# Altium project MiniPC.PrjPcb (part 1 of 17)
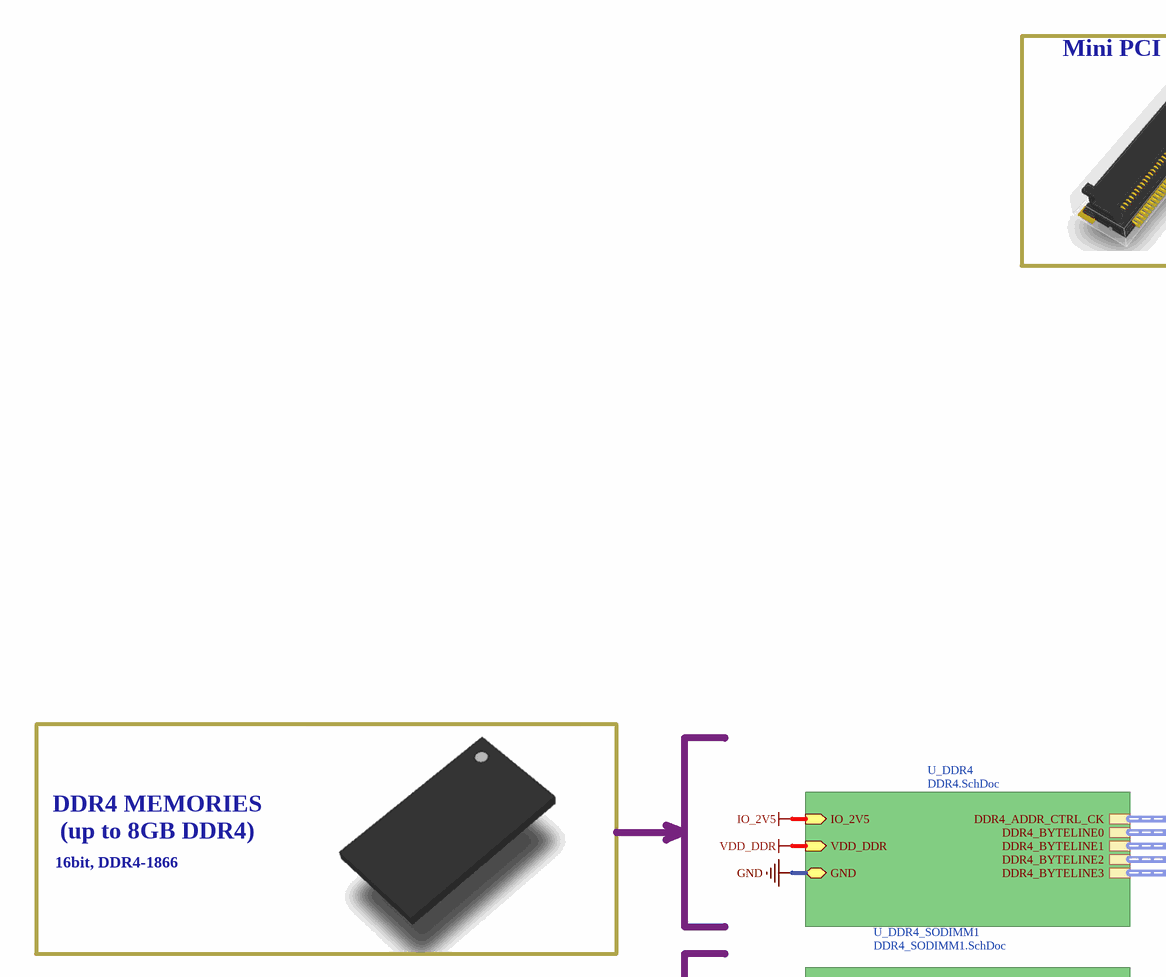
[diagram p0: MiniPC_Func.SchDoc, top left]
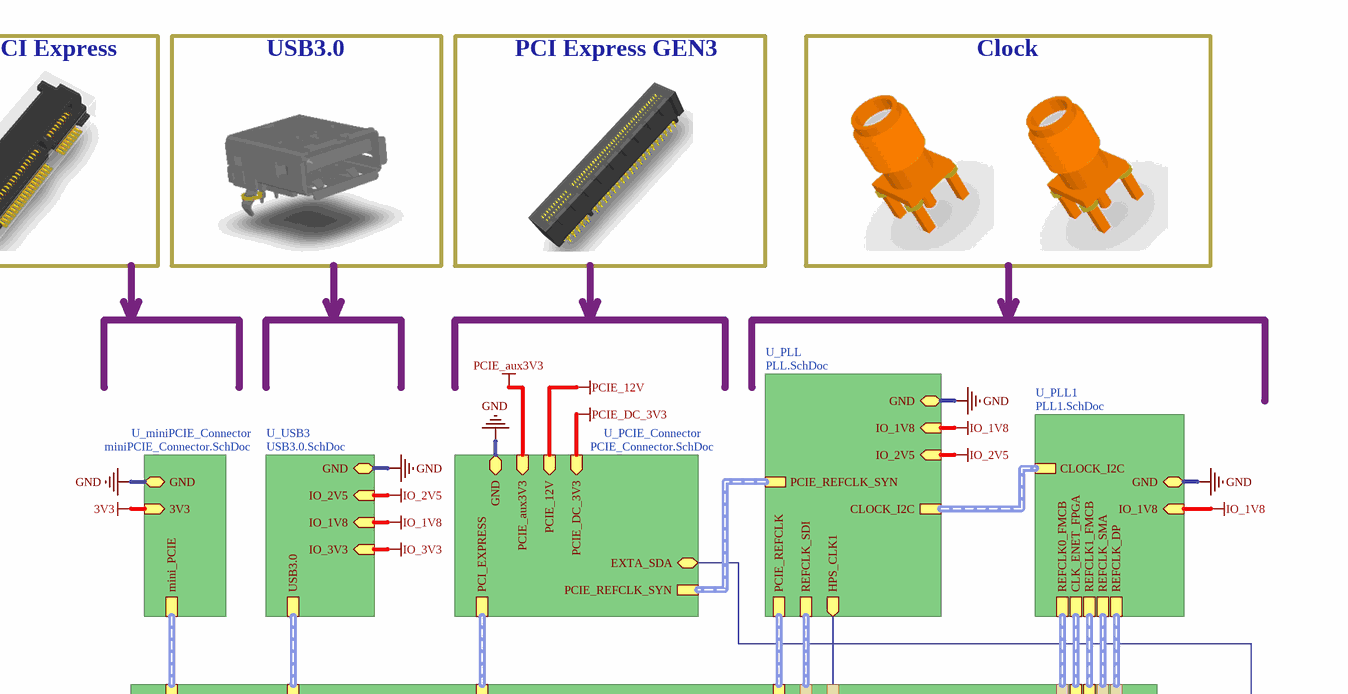
[diagram p1: MiniPC_Func.SchDoc, top middle]
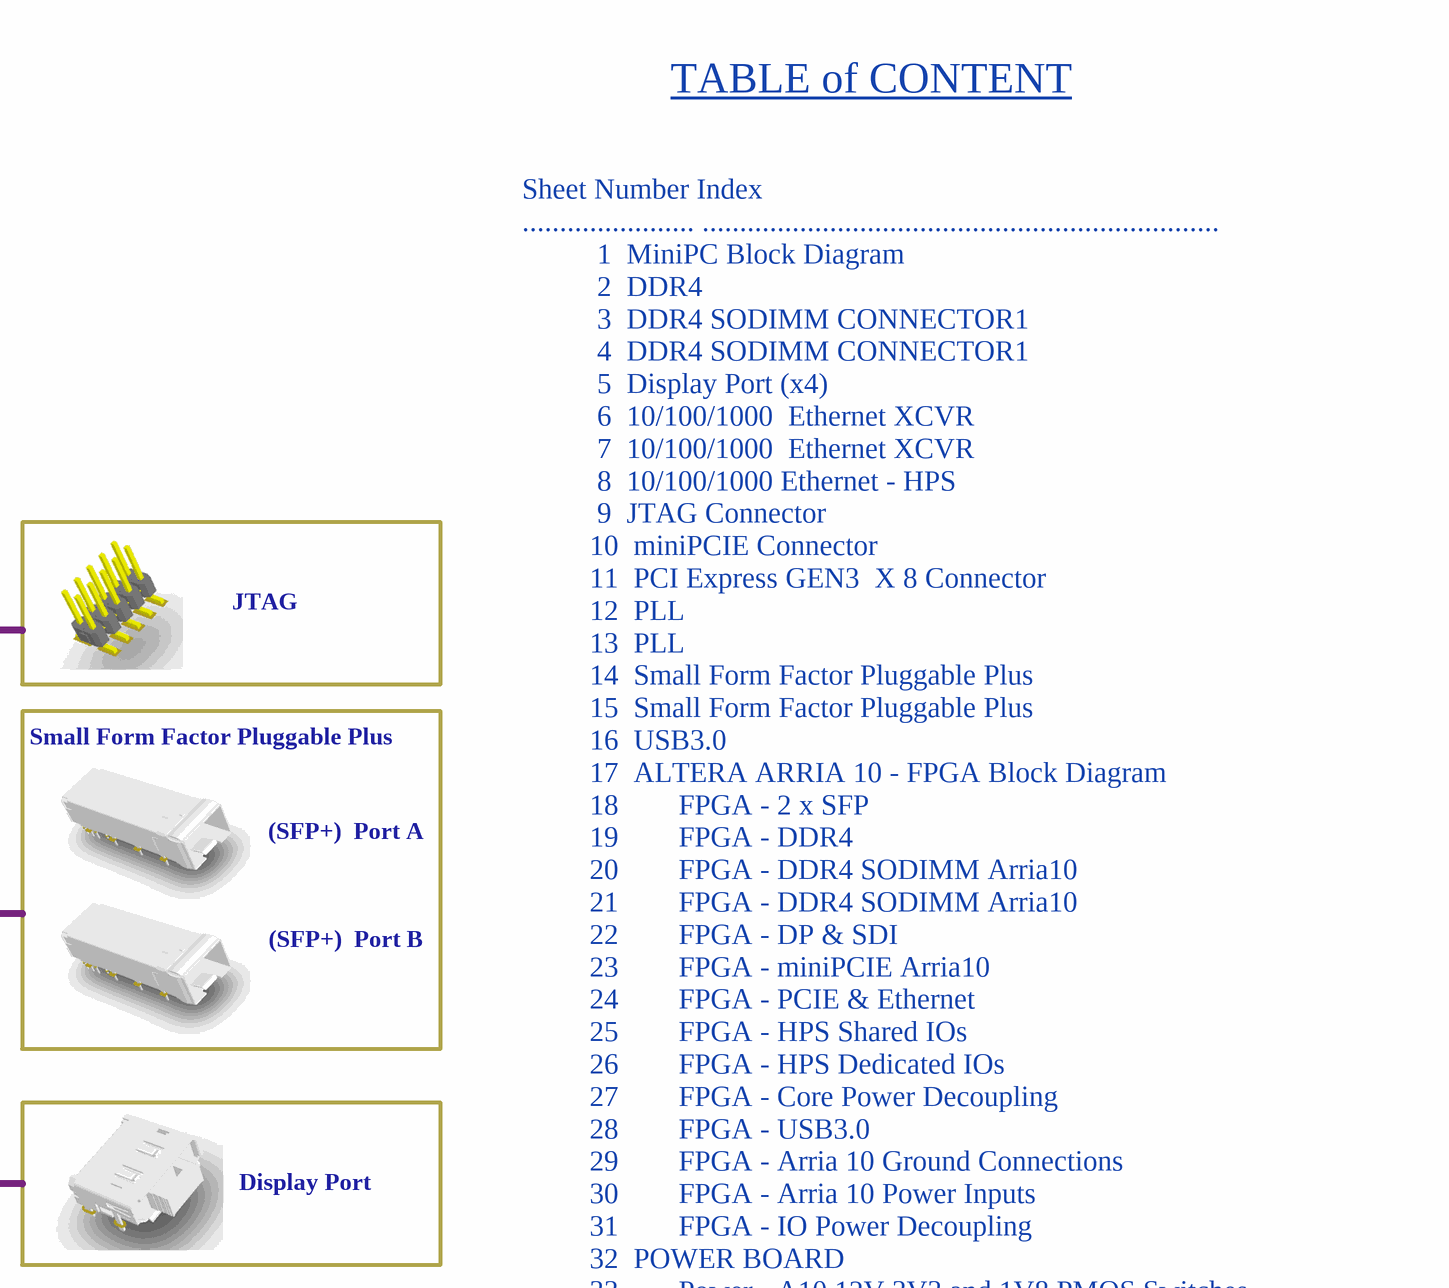
[diagram p2: MiniPC_Func.SchDoc, top right]
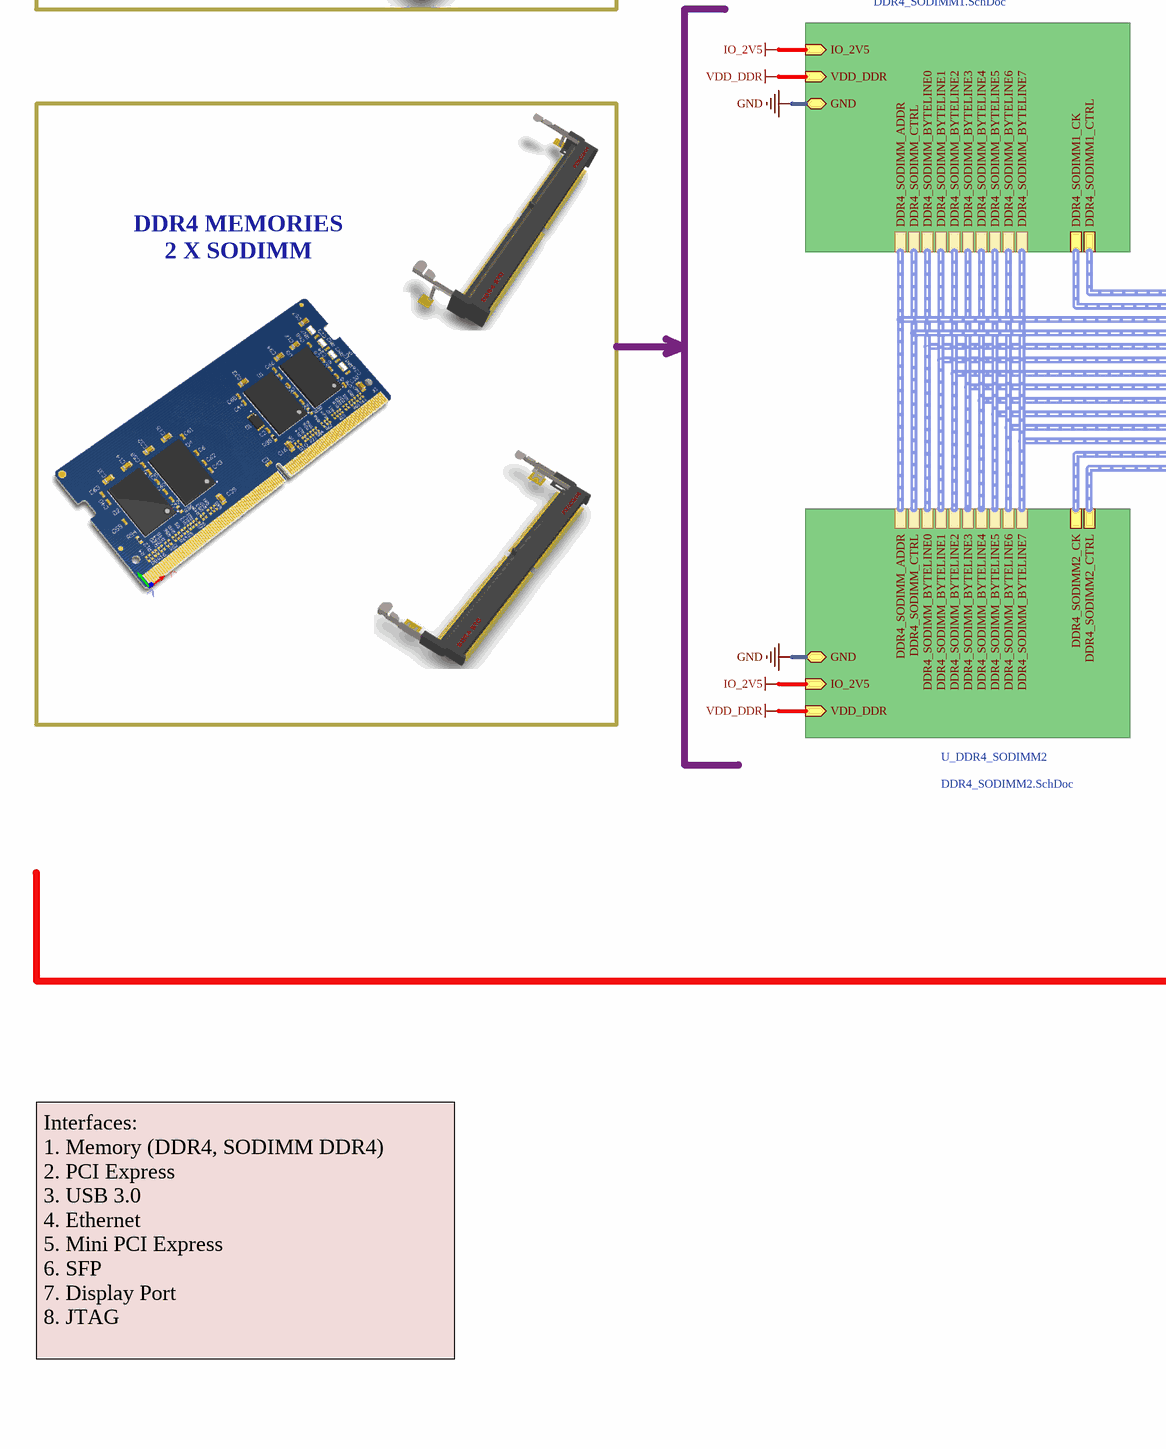
[diagram p3: MiniPC_Func.SchDoc, bottom left]
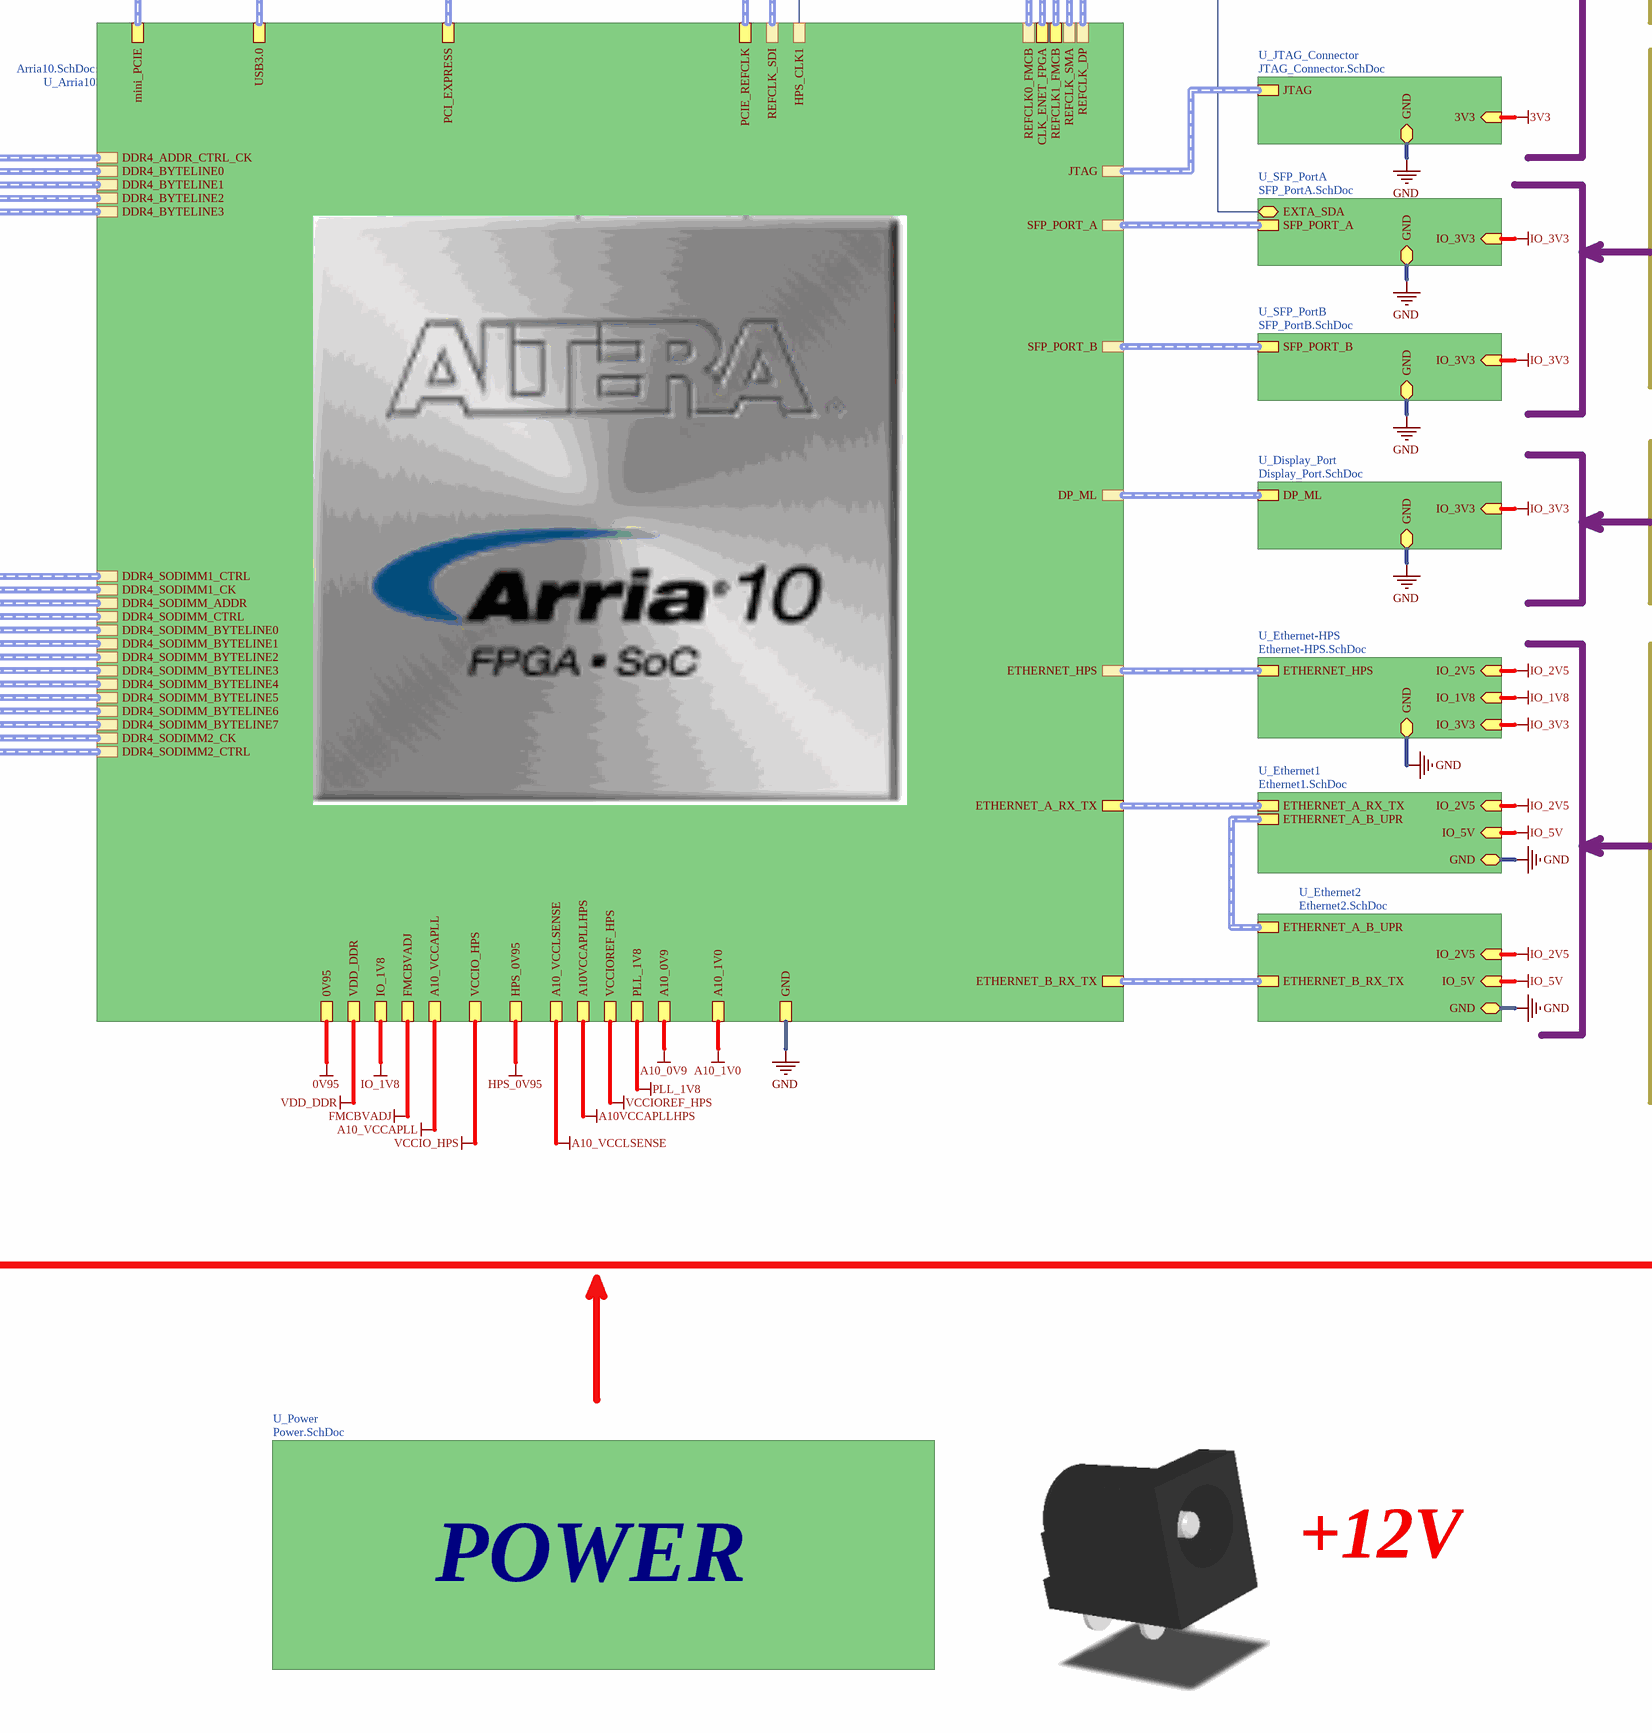
[diagram p4: MiniPC_Func.SchDoc, bottom middle]
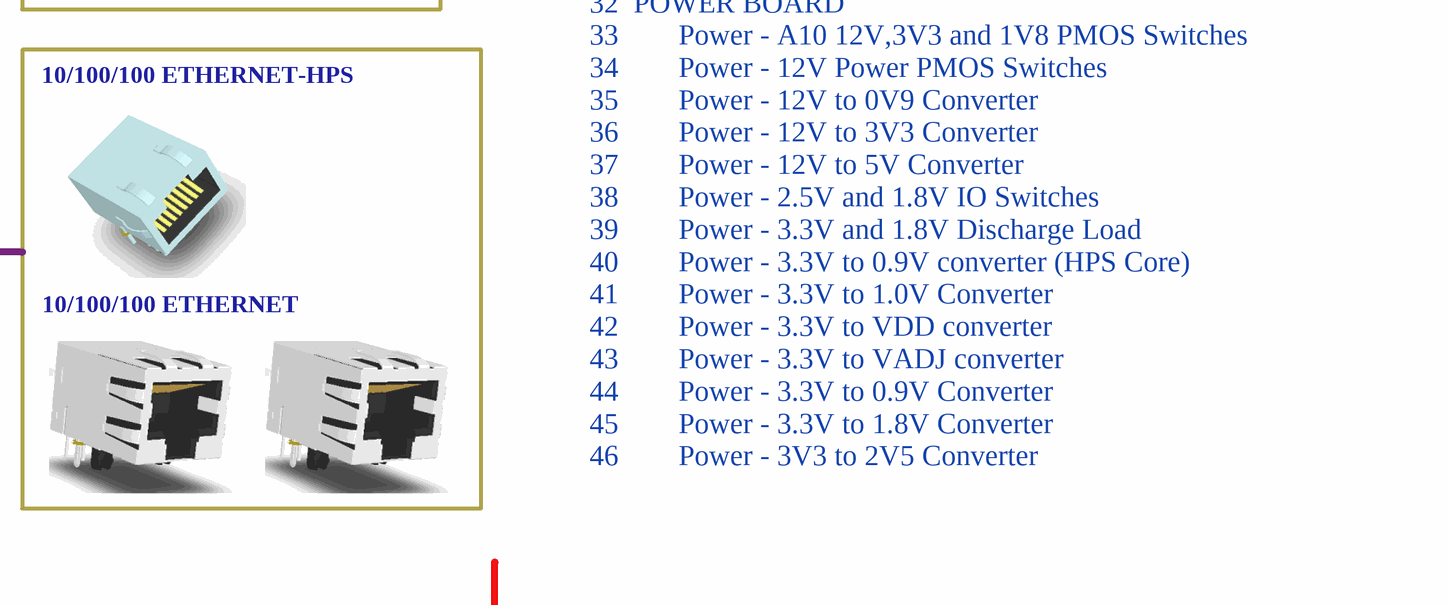
[diagram p5: MiniPC_Func.SchDoc, bottom right]
Project: Mini PC Motherboard; PrjCompanyName: Altium; PrjAddress4: 92037; PrjAddress3: La Jolla, CA, USA; PrjAddress2: Suite 700; PrjAddress1: 4225 Executive Sqr; CompanyWebsite: www.altium.com
46 sheets, 1044 parts. Net scope: hierarchical (ports join the sheet entries above them; power ports are global).
Board file: MiniPC.PcbDoc
Sheets:
  MiniPC_Func.SchDoc
    U_Arria10 = Arria10.SchDoc
      Core_Power_Capacitors = Core_Power_Decoupling.SchDoc
      IO_Power_Capacitors = IO_Power_Decoupling.SchDoc
      U_DDR4_Arria10 = DDR4_Arria10.SchDoc
      U_DDR4_SODIMM1_Arria10 = DDR4_SODIMM1_Arria10.SchDoc
      U_DDR4_SODIMM_Arria10 = DDR4_SODIMM_Arria10.SchDoc
      U_miniPCIE_Arria10 = miniPCIE_Arria10.SchDoc
      U_USB3 = USB3.0_Arria10.SchDoc
      U_PCIE_Arria10 = PCIE_Arria10.SchDoc
      U_HPS_Arria10 = HPS_Arria10.SchDoc
      U_DP&SDI_Arria10 = DP&SDI_Arria10.SchDoc
      U_2XSFP_Arria10 = 2XSFP_Arria10.SchDoc
      U_HPS1_Arria10 = HPS1_Arria10.SchDoc
      U_Arria10_Power = Arria10_Power.SchDoc
      U_Arria10_Ground = Arria10_Ground.SchDoc
    U_DDR4 = DDR4.SchDoc
    U_DDR4_SODIMM1 = DDR4_SODIMM1.SchDoc
    U_DDR4_SODIMM2 = DDR4_SODIMM2.SchDoc
    U_Ethernet-HPS = Ethernet-HPS.SchDoc
    U_SFP_PortA = SFP_PortA.SchDoc
    U_SFP_PortB = SFP_PortB.SchDoc
    U_JTAG_Connector = JTAG_Connector.SchDoc
    U_Display_Port = Display_Port.SchDoc
    U_Ethernet1 = Ethernet1.SchDoc
    U_Ethernet2 = Ethernet2.SchDoc
    U_miniPCIE_Connector = miniPCIE_Connector.SchDoc
    U_USB3 = USB3.0.SchDoc
    U_PCIE_Connector = PCIE_Connector.SchDoc
    U_PLL1 = PLL1.SchDoc
    U_PLL = PLL.SchDoc
    U_Power = Power.SchDoc
      12V_POWER = 12V_POWER.SchDoc
      12V_3V3_1V8_Swiches = 12V_3V3_1V8_Swiches.SchDoc
      12V_to_0V9 = 12V_to_0V9.SchDoc
      12V_to_3V3 = 12V_to_3V3.SchDoc
      12V_to_5V = 12V_to_5V.SchDoc
      3V3 to 0V9_Core = 3.3V_to_0.9V.SchDoc
      3V3 to 1V0 = 3.3V_to_1.0V.SchDoc
      3V3 to VDD DDR4 = 3.3V_to_DDR4_VDD.SchDoc
      3V3 to VADJ = 3.3V_to_VADJ.SchDoc
      3V3_to_0V9_Converter = 3V3_to_0V9.SchDoc
      3V3_to_2V5 = 3V3_to_2V5.SchDoc
      3V3_to_1V8 = 3V3_to_1V8.SchDoc
      2V5 and 1V8 Switches = 2.5V_and_1.8V_Switches.SchDoc
      3.3V_and_1.8V_Load = 3.3V_and_1.8V_Load.SchDoc

## Sheet MiniPC_Func.SchDoc: MiniPC Block Diagram
size D; DocumentNumber: 1; SheetNumber: 1; SheetTotal: 46

### Sub-sheets
U_Arria10 = Arria10.SchDoc: IO_1V8, VDD_DDR, FMCBVADJ, A10_VCCAPLL, HPS_0V95, VCCIO_HPS, VCCIOREF_HPS, A10VCCAPLLHPS, A10_VCCLSENSE, 0V95, PLL_1V8, A10_1V0, A10_0V9, DDR4_ADDR_CTRL_CK, DDR4_BYTELINE0, DDR4_BYTELINE1, DDR4_BYTELINE2, DDR4_BYTELINE3, DDR4_SODIMM_ADDR, DDR4_SODIMM1_CK, DDR4_SODIMM2_CK, DDR4_SODIMM_BYTELINE0, DDR4_SODIMM_BYTELINE1, DDR4_SODIMM_BYTELINE2, DDR4_SODIMM_BYTELINE3, DDR4_SODIMM_BYTELINE4, DDR4_SODIMM_BYTELINE5, DDR4_SODIMM_BYTELINE6, DDR4_SODIMM_BYTELINE7, DDR4_SODIMM_CTRL, DDR4_SODIMM1_CTRL, DDR4_SODIMM2_CTRL, mini_PCIE, JTAG, SFP_PORT_A, SFP_PORT_B, REFCLK0_FMCB, REFCLK_SMA, REFCLK_DP, REFCLK_SDI, DP_ML, ETHERNET_HPS, HPS_CLK1, USB3.0, ETHERNET_A_RX_TX, ETHERNET_B_RX_TX, PCI_EXPRESS, CLK_ENET_FPGA, PCIE_REFCLK, REFCLK1_FMCB, GND
U_DDR4 = DDR4.SchDoc: DDR4_ADDR_CTRL_CK (harness DDR4_ADDR_CTRL_CK), DDR4_BYTELINE0 (harness DDR4_BYTELINE0), DDR4_BYTELINE1 (harness DDR4_BYTELINE1), DDR4_BYTELINE2 (harness DDR4_BYTELINE2), DDR4_BYTELINE3 (harness DDR4_BYTELINE3), IO_2V5 (in), VDD_DDR (in), GND
U_DDR4_SODIMM1 = DDR4_SODIMM1.SchDoc: DDR4_SODIMM1_CTRL (harness DDR4_SODIMM1_CTRL), DDR4_SODIMM_BYTELINE0 (harness DDR4_SODIMM_BYTELINE0), DDR4_SODIMM_BYTELINE1 (harness DDR4_SODIMM_BYTELINE1), DDR4_SODIMM_BYTELINE2 (harness DDR4_SODIMM_BYTELINE2), DDR4_SODIMM_BYTELINE3 (harness DDR4_SODIMM_BYTELINE3), DDR4_SODIMM_BYTELINE4 (harness DDR4_SODIMM_BYTELINE4), DDR4_SODIMM_BYTELINE5 (harness DDR4_SODIMM_BYTELINE5), DDR4_SODIMM_BYTELINE6 (harness DDR4_SODIMM_BYTELINE6), DDR4_SODIMM_BYTELINE7 (harness DDR4_SODIMM_BYTELINE7), DDR4_SODIMM_ADDR (harness DDR4_SODIMM_ADDR), DDR4_SODIMM_CTRL (harness DDR4_SODIMM_CTRL), DDR4_SODIMM1_CK (harness DDR4_SODIMM1_CK), IO_2V5 (in), VDD_DDR (in), GND
U_DDR4_SODIMM2 = DDR4_SODIMM2.SchDoc: DDR4_SODIMM_ADDR (harness DDR4_SODIMM_ADDR), DDR4_SODIMM_CTRL (harness DDR4_SODIMM_CTRL), DDR4_SODIMM_BYTELINE0 (harness DDR4_SODIMM_BYTELINE0), DDR4_SODIMM_BYTELINE1 (harness DDR4_SODIMM_BYTELINE1), DDR4_SODIMM_BYTELINE2 (harness DDR4_SODIMM_BYTELINE2), DDR4_SODIMM_BYTELINE3 (harness DDR4_SODIMM_BYTELINE3), DDR4_SODIMM_BYTELINE4 (harness DDR4_SODIMM_BYTELINE4), DDR4_SODIMM_BYTELINE5 (harness DDR4_SODIMM_BYTELINE5), DDR4_SODIMM_BYTELINE6 (harness DDR4_SODIMM_BYTELINE6), DDR4_SODIMM_BYTELINE7 (harness DDR4_SODIMM_BYTELINE7), DDR4_SODIMM2_CTRL (harness DDR4_SODIMM2_CTRL), DDR4_SODIMM2_CK (harness DDR4_SODIMM2_CK), IO_2V5 (in), VDD_DDR (in), GND
U_Display_Port = Display_Port.SchDoc: DP_ML (harness DP_ML), IO_3V3 (in), GND
U_Ethernet1 = Ethernet1.SchDoc: ETHERNET_A_RX_TX (harness ETHERNET_A_RX_TX), ETHERNET_A_B_UPR (harness ETHERNET_A_B_UPR), IO_2V5 (in), IO_5V (in), GND
U_Ethernet2 = Ethernet2.SchDoc: ETHERNET_A_B_UPR (harness ETHERNET_A_B_UPR), ETHERNET_B_RX_TX (harness ETHERNET_B_RX_TX), IO_2V5 (in), IO_5V (in), GND
U_Ethernet-HPS = Ethernet-HPS.SchDoc: ETHERNET_HPS (harness ETHERNET_HPS), IO_1V8 (in), IO_2V5 (in), IO_3V3 (in), GND
U_JTAG_Connector = JTAG_Connector.SchDoc: JTAG (harness JTAG), 3V3 (in), GND
U_miniPCIE_Connector = miniPCIE_Connector.SchDoc: mini_PCIE (harness mini_PCIE), 3V3 (in), GND
U_PCIE_Connector = PCIE_Connector.SchDoc: EXTA_SDA (bidir), PCI_EXPRESS (harness PCI_EXPRESS), PCIE_REFCLK_SYN (harness PCIE_REFCLK_SYN), PCIE_DC_3V3 (in), PCIE_12V (in), PCIE_aux3V3 (in), GND
U_PLL = PLL.SchDoc: PCIE_REFCLK (harness REFCLK), PCIE_REFCLK_SYN (harness PCIE_REFCLK_SYN), REFCLK_SDI (harness REFCLK_SDI), HPS_CLK1 (out), CLOCK_I2C (harness CLOCK_I2C), IO_2V5 (in), IO_1V8 (in), GND
U_PLL1 = PLL1.SchDoc: REFCLK0_FMCB (harness REFCLK0_FMCB), CLK_ENET_FPGA (harness CLK_ENET), REFCLK1_FMCB (harness REFCLK1_FMCB), REFCLK_SMA (harness REFCLK_SMA), REFCLK_DP (harness REFCLK_DP), CLOCK_I2C (harness CLOCK_I2C), IO_1V8 (in), GND
U_Power = Power.SchDoc: no entries
U_SFP_PortA = SFP_PortA.SchDoc: EXTA_SDA (bidir), SFP_PORT_A (harness SFP_PORT_A), IO_3V3 (in), GND
U_SFP_PortB = SFP_PortB.SchDoc: SFP_PORT_B (harness SFP_PORT_B), IO_3V3 (in), GND
U_USB3 = USB3.0.SchDoc: USB3.0 (harness USB3.0), IO_1V8 (in), IO_2V5 (in), IO_3V3 (in), GND

### Nets
3V3: sheet U_JTAG_Connector/3V3, sheet U_miniPCIE_Connector/3V3
GND: sheet U_Arria10/GND, sheet U_DDR4/GND, sheet U_DDR4_SODIMM1/GND, sheet U_DDR4_SODIMM2/GND, sheet U_Ethernet-HPS/GND, sheet U_SFP_PortA/GND, sheet U_SFP_PortB/GND, sheet U_JTAG_Connector/GND, sheet U_Display_Port/GND, sheet U_Ethernet1/GND, sheet U_Ethernet2/GND, sheet U_miniPCIE_Connector/GND, sheet U_USB3/GND, sheet U_PCIE_Connector/GND, sheet U_PLL1/GND, sheet U_PLL/GND
IO_1V8: sheet U_Arria10/IO_1V8, sheet U_Ethernet-HPS/IO_1V8, sheet U_USB3/IO_1V8, sheet U_PLL1/IO_1V8, sheet U_PLL/IO_1V8
IO_2V5: sheet U_DDR4/IO_2V5, sheet U_DDR4_SODIMM1/IO_2V5, sheet U_DDR4_SODIMM2/IO_2V5, sheet U_Ethernet-HPS/IO_2V5, sheet U_Ethernet1/IO_2V5, sheet U_Ethernet2/IO_2V5, sheet U_USB3/IO_2V5, sheet U_PLL/IO_2V5
IO_3V3: sheet U_Ethernet-HPS/IO_3V3, sheet U_SFP_PortA/IO_3V3, sheet U_SFP_PortB/IO_3V3, sheet U_Display_Port/IO_3V3, sheet U_USB3/IO_3V3
IO_5V: sheet U_Ethernet1/IO_5V, sheet U_Ethernet2/IO_5V
VDD_DDR: sheet U_Arria10/VDD_DDR, sheet U_DDR4/VDD_DDR, sheet U_DDR4_SODIMM1/VDD_DDR, sheet U_DDR4_SODIMM2/VDD_DDR
EXTA_SDA: sheet U_SFP_PortA/EXTA_SDA, sheet U_PCIE_Connector/EXTA_SDA
HPS_CLK1: sheet U_Arria10/HPS_CLK1, sheet U_PLL/HPS_CLK1

### Buses and harness runs
harness sheet U_Arria10/CLK_ENET_FPGA = sheet U_PLL1/CLK_ENET_FPGA
harness sheet U_Arria10/DDR4_ADDR_CTRL_CK = sheet U_DDR4/DDR4_ADDR_CTRL_CK
harness sheet U_Arria10/DDR4_BYTELINE0 = sheet U_DDR4/DDR4_BYTELINE0
harness sheet U_Arria10/DDR4_BYTELINE1 = sheet U_DDR4/DDR4_BYTELINE1
harness sheet U_Arria10/DDR4_BYTELINE2 = sheet U_DDR4/DDR4_BYTELINE2
harness sheet U_Arria10/DDR4_BYTELINE3 = sheet U_DDR4/DDR4_BYTELINE3
harness sheet U_Arria10/DDR4_SODIMM1_CK = sheet U_DDR4_SODIMM1/DDR4_SODIMM1_CK
harness sheet U_Arria10/DDR4_SODIMM1_CTRL = sheet U_DDR4_SODIMM1/DDR4_SODIMM1_CTRL
harness sheet U_Arria10/DDR4_SODIMM2_CK = sheet U_DDR4_SODIMM2/DDR4_SODIMM2_CK
harness sheet U_Arria10/DDR4_SODIMM2_CTRL = sheet U_DDR4_SODIMM2/DDR4_SODIMM2_CTRL
harness sheet U_Arria10/DDR4_SODIMM_ADDR = sheet U_DDR4_SODIMM1/DDR4_SODIMM_ADDR = sheet U_DDR4_SODIMM2/DDR4_SODIMM_ADDR
harness sheet U_Arria10/DDR4_SODIMM_BYTELINE0 = sheet U_DDR4_SODIMM1/DDR4_SODIMM_BYTELINE0 = sheet U_DDR4_SODIMM2/DDR4_SODIMM_BYTELINE0
harness sheet U_Arria10/DDR4_SODIMM_BYTELINE1 = sheet U_DDR4_SODIMM1/DDR4_SODIMM_BYTELINE1 = sheet U_DDR4_SODIMM2/DDR4_SODIMM_BYTELINE1
harness sheet U_Arria10/DDR4_SODIMM_BYTELINE2 = sheet U_DDR4_SODIMM1/DDR4_SODIMM_BYTELINE2 = sheet U_DDR4_SODIMM2/DDR4_SODIMM_BYTELINE2
harness sheet U_Arria10/DDR4_SODIMM_BYTELINE3 = sheet U_DDR4_SODIMM1/DDR4_SODIMM_BYTELINE3 = sheet U_DDR4_SODIMM2/DDR4_SODIMM_BYTELINE3
harness sheet U_Arria10/DDR4_SODIMM_BYTELINE4 = sheet U_DDR4_SODIMM1/DDR4_SODIMM_BYTELINE4 = sheet U_DDR4_SODIMM2/DDR4_SODIMM_BYTELINE4
harness sheet U_Arria10/DDR4_SODIMM_BYTELINE5 = sheet U_DDR4_SODIMM1/DDR4_SODIMM_BYTELINE5 = sheet U_DDR4_SODIMM2/DDR4_SODIMM_BYTELINE5
harness sheet U_Arria10/DDR4_SODIMM_BYTELINE6 = sheet U_DDR4_SODIMM1/DDR4_SODIMM_BYTELINE6 = sheet U_DDR4_SODIMM2/DDR4_SODIMM_BYTELINE6
harness sheet U_Arria10/DDR4_SODIMM_BYTELINE7 = sheet U_DDR4_SODIMM1/DDR4_SODIMM_BYTELINE7 = sheet U_DDR4_SODIMM2/DDR4_SODIMM_BYTELINE7
harness sheet U_Arria10/DDR4_SODIMM_CTRL = sheet U_DDR4_SODIMM1/DDR4_SODIMM_CTRL = sheet U_DDR4_SODIMM2/DDR4_SODIMM_CTRL
harness sheet U_Arria10/DP_ML = sheet U_Display_Port/DP_ML
harness sheet U_Arria10/ETHERNET_A_RX_TX = sheet U_Ethernet1/ETHERNET_A_RX_TX
harness sheet U_Arria10/ETHERNET_B_RX_TX = sheet U_Ethernet2/ETHERNET_B_RX_TX
harness sheet U_Arria10/ETHERNET_HPS = sheet U_Ethernet-HPS/ETHERNET_HPS
harness sheet U_Arria10/JTAG = sheet U_JTAG_Connector/JTAG
harness sheet U_Arria10/mini_PCIE = sheet U_miniPCIE_Connector/mini_PCIE
harness sheet U_Arria10/PCI_EXPRESS = sheet U_PCIE_Connector/PCI_EXPRESS
harness sheet U_Arria10/PCIE_REFCLK = sheet U_PLL/PCIE_REFCLK
harness sheet U_Arria10/REFCLK0_FMCB = sheet U_PLL1/REFCLK0_FMCB
harness sheet U_Arria10/REFCLK1_FMCB = sheet U_PLL1/REFCLK1_FMCB
harness sheet U_Arria10/REFCLK_DP = sheet U_PLL1/REFCLK_DP
harness sheet U_Arria10/REFCLK_SDI = sheet U_PLL/REFCLK_SDI
harness sheet U_Arria10/REFCLK_SMA = sheet U_PLL1/REFCLK_SMA
harness sheet U_Arria10/SFP_PORT_A = sheet U_SFP_PortA/SFP_PORT_A
harness sheet U_Arria10/SFP_PORT_B = sheet U_SFP_PortB/SFP_PORT_B
harness sheet U_Arria10/USB3.0 = sheet U_USB3/USB3.0
harness sheet U_Ethernet1/ETHERNET_A_B_UPR = sheet U_Ethernet2/ETHERNET_A_B_UPR
harness sheet U_PCIE_Connector/PCIE_REFCLK_SYN = sheet U_PLL/PCIE_REFCLK_SYN
harness sheet U_PLL1/CLOCK_I2C = sheet U_PLL/CLOCK_I2C

### Notes on the sheet
- Mini PCI Express
- USB3.0
- PCI Express GEN3
- Clock
- TABLE of CONTENT
- JTAG
- Small Form Factor Pluggable Plus
- DDR4 MEMORIES
- 16bit, DDR4-1866
- (up to 8GB DDR4)
- (SFP+)  Port A
- (SFP+)  Port B
- 2 X SODIMM
- Display Port
- 10/100/100 ETHERNET-HPS
- 10/100/100 ETHERNET
- Sheet Number	Index
  .......................	.....................................................................
  1		MiniPC Block Diagram
  2		DDR4
  3		DDR4 SODIMM CONNECTOR1
  4		DDR4 SODIMM CONNECTOR1
  5		Display Port (x4)
  6		10/100/1000  Ethernet XCVR
  7		10/100/1000  Ethernet XCVR
  8		10/100/1000 Ethernet - HPS
  9		JTAG Connector
  10		miniPCIE Connector
  11		PCI Express GEN3  X 8 Connector
  12		PLL
  13		PLL
  14		Small Form Factor Pluggable Plus
  15		Small Form Factor Pluggable Plus
  16		USB3.0
  17		ALTERA ARRIA 10 - FPGA Block Diagram
  18		      FPGA - 2 x SFP
  19		      FPGA - DDR4
  20		      FPGA - DDR4 SODIMM Arria10
  21		      FPGA - DDR4 SODIMM Arria10
  22		      FPGA - DP & SDI
  23		      FPGA - miniPCIE Arria10
  24		      FPGA - PCIE & Ethernet
  25		      FPGA - HPS Shared IOs
  26		      FPGA - HPS Dedicated IOs
  27		      FPGA - Core Power Decoupling
  28		      FPGA - USB3.0
  29		      FPGA - Arria 10 Ground Connections
  30		      FPGA - Arria 10 Power Inputs
  31		      FPGA - IO Power Decoupling
  32		POWER BOARD
  33		      Power - A10 12V,3V3 and 1V8 PMOS Switches
  34		      Power - 12V Power PMOS Switches
  35		      Power - 12V to 0V9 Converter
  36		      Power - 12V to 3V3 Converter
  37		      Power - 12V to 5V Converter
  38		      Power - 2.5V and 1.8V IO Switches
  39		      Power - 3.3V and 1.8V Discharge Load
  40		      Power - 3.3V to 0.9V converter (HPS Core)
  41		      Power - 3.3V to 1.0V Converter
  42		      Power - 3.3V to VDD converter
  43		      Power - 3.3V to VADJ converter
  44		      Power - 3.3V to 0.9V Converter
  45		      Power - 3.3V to 1.8V Converter
  46		      Power - 3V3 to 2V5 Converter
- +12V
- Interfaces:
  1. Memory (DDR4, SODIMM DDR4)
  2. PCI Express
  3. USB 3.0
  4. Ethernet
  5. Mini PCI Express
  6. SFP
  7. Display Port
  8. JTAG
- POWER
- Title
- Size:
- Date:
- File:
- B
- Number:
- Time:
- Revision:
- Sheet
- of

## Sheet Arria10.SchDoc: ALTERA ARRIA 10 Block Diagram
size C; DocumentNumber: 17; SheetNumber: 17; SheetTotal: 46
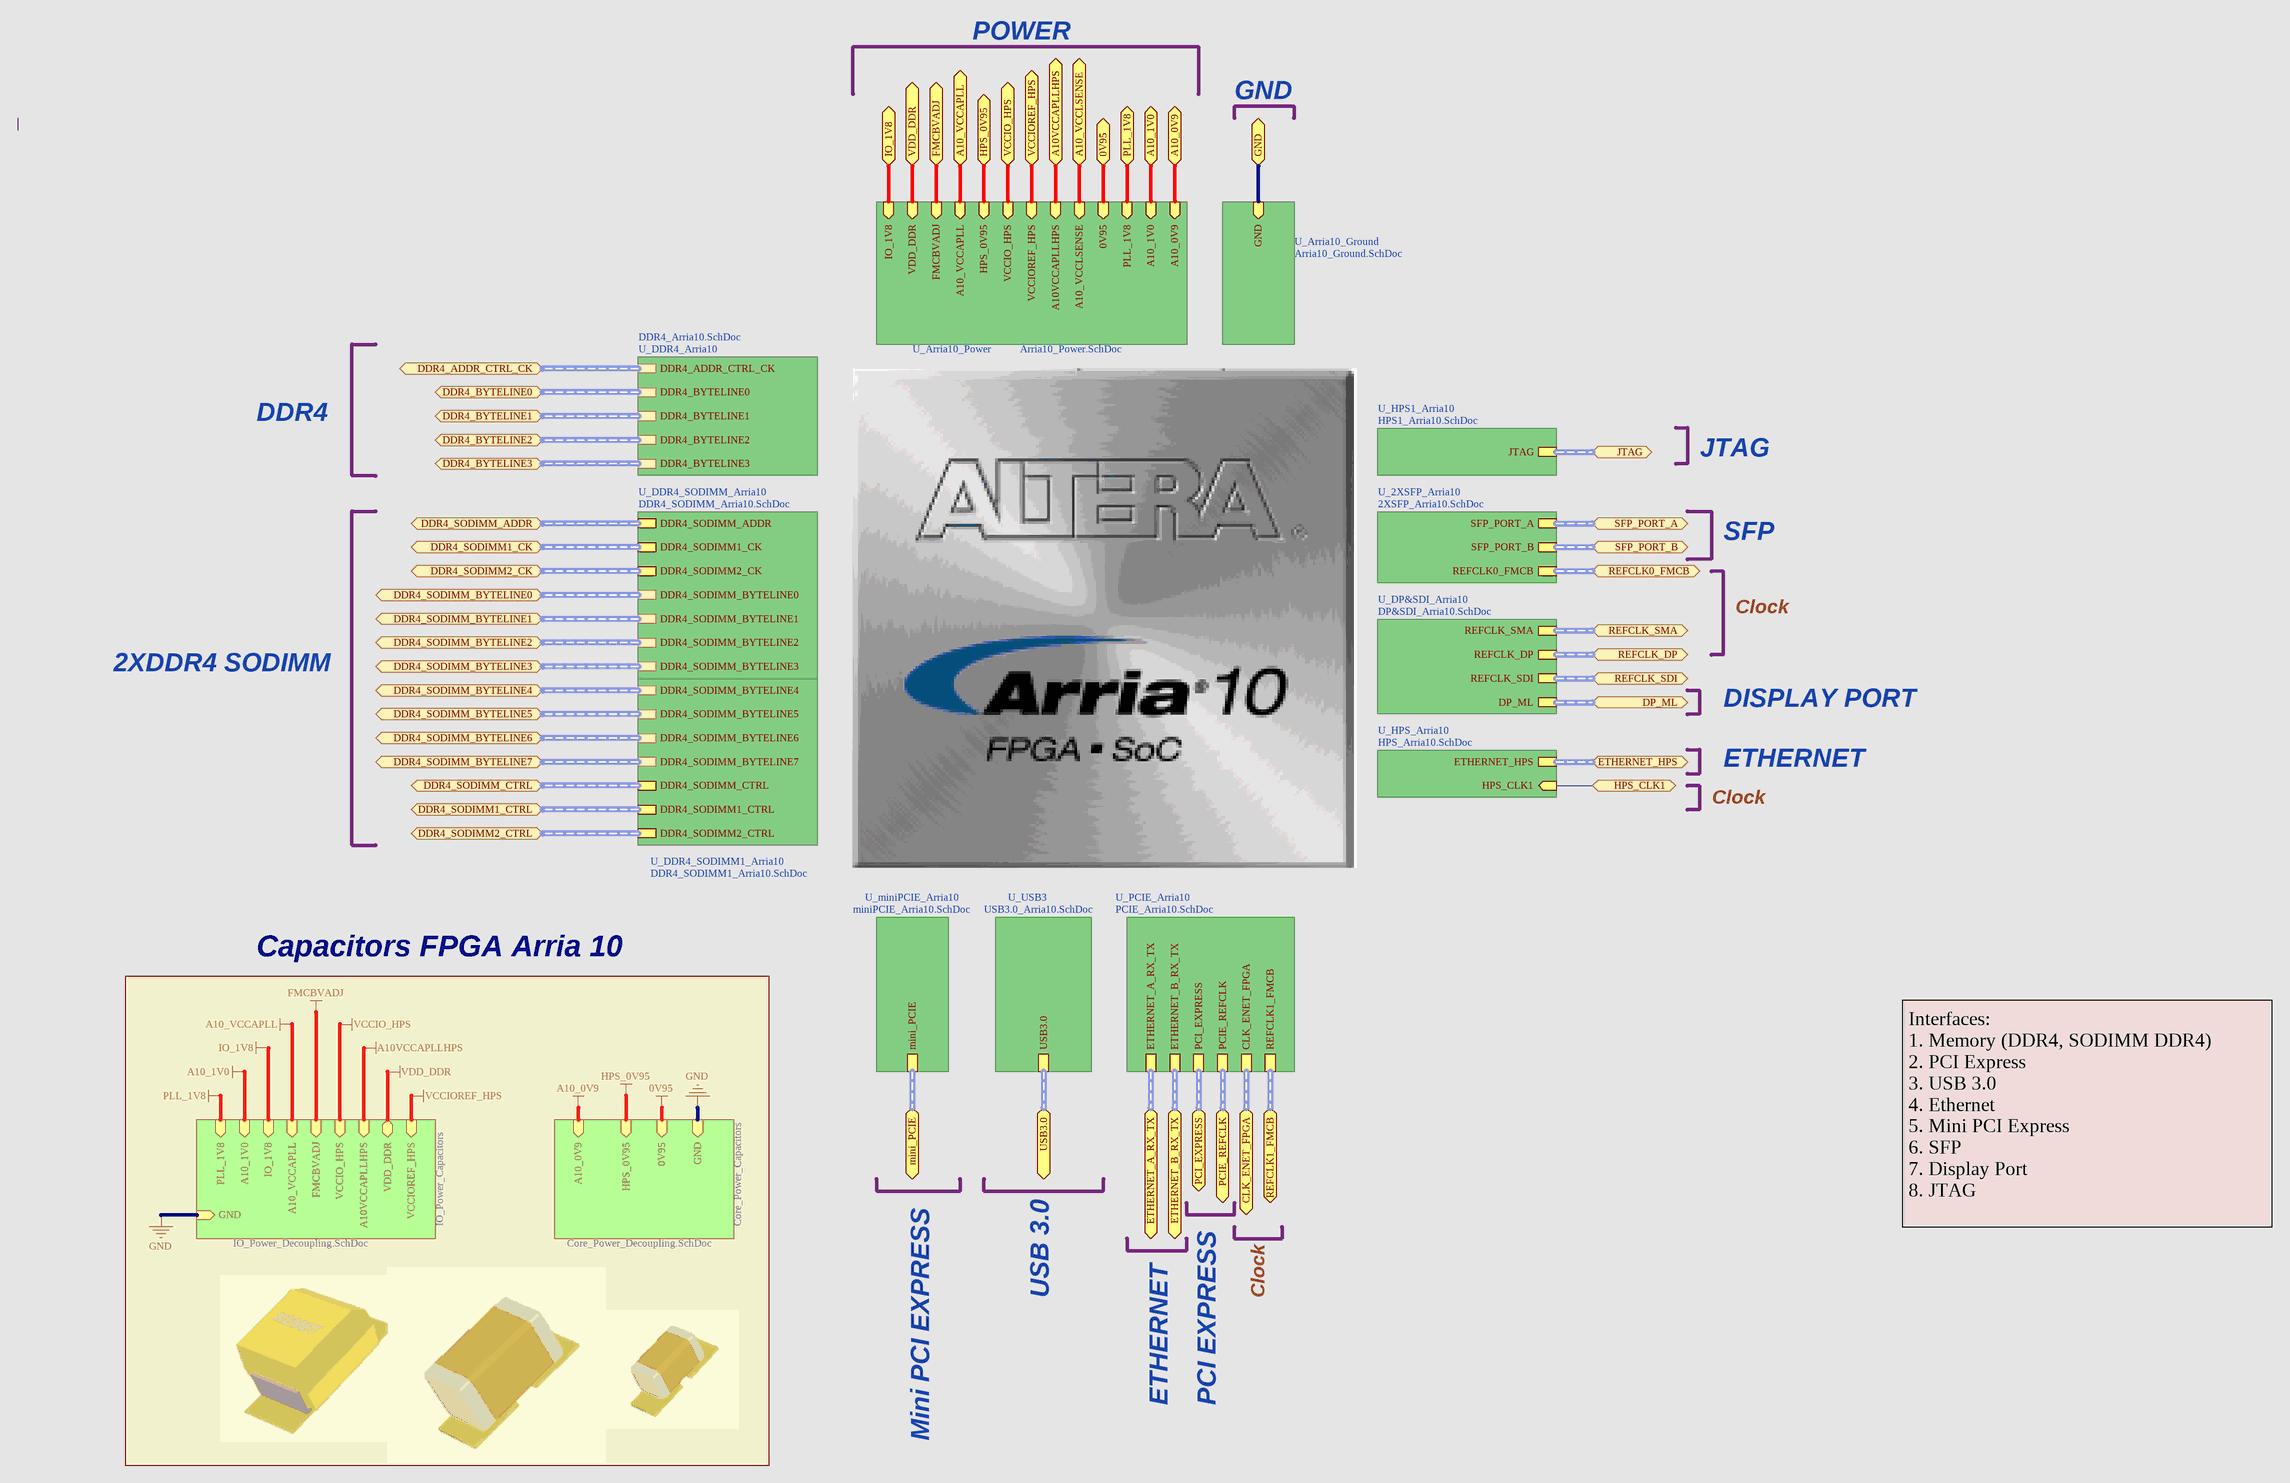
[diagram p6: Arria10.SchDoc]

### Sub-sheets
Core_Power_Capacitors = Core_Power_Decoupling.SchDoc: A10_0V9 (in), HPS_0V95 (in), 0V95 (in), GND (in)
IO_Power_Capacitors = IO_Power_Decoupling.SchDoc: PLL_1V8 (in), A10_1V0 (in), IO_1V8 (in), A10VCCAPLLHPS (in), VDD_DDR, VCCIOREF_HPS (in), A10_VCCAPLL (in), VCCIO_HPS (in), FMCBVADJ (in), GND (in)
U_2XSFP_Arria10 = 2XSFP_Arria10.SchDoc: REFCLK0_FMCB (harness REFCLK0_FMCB), SFP_PORT_B (harness SFP_PORT_B), SFP_PORT_A (harness SFP_PORT_A)
U_Arria10_Ground = Arria10_Ground.SchDoc: GND (in)
U_Arria10_Power = Arria10_Power.SchDoc: IO_1V8 (in), VDD_DDR (in), FMCBVADJ (in), A10_VCCAPLL (in), HPS_0V95 (in), VCCIO_HPS (in), VCCIOREF_HPS (in), A10VCCAPLLHPS (in), A10_VCCLSENSE (in), 0V95 (in), PLL_1V8 (in), A10_1V0 (in), A10_0V9 (in)
U_DDR4_Arria10 = DDR4_Arria10.SchDoc: DDR4_ADDR_CTRL_CK (harness DDR4_ADDR_CTRL_CK), DDR4_BYTELINE0 (harness DDR4_BYTELINE0), DDR4_BYTELINE1 (harness DDR4_BYTELINE1), DDR4_BYTELINE2 (harness DDR4_BYTELINE2), DDR4_BYTELINE3 (harness DDR4_BYTELINE3)
U_DDR4_SODIMM1_Arria10 = DDR4_SODIMM1_Arria10.SchDoc: DDR4_SODIMM1_CTRL (harness DDR4_SODIMM1_CTRL), DDR4_SODIMM2_CTRL (harness DDR4_SODIMM2_CTRL), DDR4_SODIMM_CTRL (harness DDR4_SODIMM_CTRL), DDR4_SODIMM_BYTELINE4 (harness DDR4_SODIMM_BYTELINE4), DDR4_SODIMM_BYTELINE5 (harness DDR4_SODIMM_BYTELINE5), DDR4_SODIMM_BYTELINE6 (harness DDR4_SODIMM_BYTELINE6), DDR4_SODIMM_BYTELINE7 (harness DDR4_SODIMM_BYTELINE7)
U_DDR4_SODIMM_Arria10 = DDR4_SODIMM_Arria10.SchDoc: DDR4_SODIMM_ADDR (harness DDR4_SODIMM_ADDR), DDR4_SODIMM1_CK (harness DDR4_SODIMM1_CK), DDR4_SODIMM2_CK (harness DDR4_SODIMM2_CK), DDR4_SODIMM_BYTELINE0 (harness DDR4_SODIMM_BYTELINE0), DDR4_SODIMM_BYTELINE1 (harness DDR4_SODIMM_BYTELINE1), DDR4_SODIMM_BYTELINE2 (harness DDR4_SODIMM_BYTELINE2), DDR4_SODIMM_BYTELINE3 (harness DDR4_SODIMM_BYTELINE3)
U_DP&SDI_Arria10 = DP&SDI_Arria10.SchDoc: REFCLK_SMA (harness REFCLK_SMA), REFCLK_DP (harness REFCLK_DP), REFCLK_SDI (harness REFCLK_SDI), DP_ML (harness DP_ML)
U_HPS1_Arria10 = HPS1_Arria10.SchDoc: JTAG (harness JTAG)
U_HPS_Arria10 = HPS_Arria10.SchDoc: HPS_CLK1 (in), ETHERNET_HPS (harness ETHERNET_HPS)
U_miniPCIE_Arria10 = miniPCIE_Arria10.SchDoc: mini_PCIE (harness mini_PCIE)
U_PCIE_Arria10 = PCIE_Arria10.SchDoc: ETHERNET_A_RX_TX (harness ETHERNET_A_RX_TX), ETHERNET_B_RX_TX (harness ETHERNET_B_RX_TX), PCI_EXPRESS (harness PCI_EXPRESS), CLK_ENET_FPGA (harness CLK_ENET), PCIE_REFCLK (harness REFCLK), REFCLK1_FMCB (harness REFCLK1_FMCB)
U_USB3 = USB3.0_Arria10.SchDoc: USB3.0 (harness USB3.0)

### Ports
0V95, A10_0V9, A10_1V0, A10_VCCAPLL, A10_VCCLSENSE, A10VCCAPLLHPS, CLK_ENET_FPGA, DDR4_ADDR_CTRL_CK, DDR4_BYTELINE0, DDR4_BYTELINE1, DDR4_BYTELINE2, DDR4_BYTELINE3, DDR4_SODIMM1_CK, DDR4_SODIMM1_CTRL, DDR4_SODIMM2_CK, DDR4_SODIMM2_CTRL, DDR4_SODIMM_ADDR, DDR4_SODIMM_BYTELINE0, DDR4_SODIMM_BYTELINE1, DDR4_SODIMM_BYTELINE2, DDR4_SODIMM_BYTELINE3, DDR4_SODIMM_BYTELINE4, DDR4_SODIMM_BYTELINE5, DDR4_SODIMM_BYTELINE6, DDR4_SODIMM_BYTELINE7, DDR4_SODIMM_CTRL, DP_ML, ETHERNET_A_RX_TX, ETHERNET_B_RX_TX, ETHERNET_HPS, FMCBVADJ, GND, HPS_0V95, HPS_CLK1, IO_1V8, JTAG, mini_PCIE, PCI_EXPRESS, PCIE_REFCLK, PLL_1V8, REFCLK0_FMCB, REFCLK1_FMCB, REFCLK_DP, REFCLK_SDI, REFCLK_SMA, SFP_PORT_A, SFP_PORT_B, USB3.0, VCCIO_HPS, VCCIOREF_HPS, VDD_DDR

### Nets
0V95: port 0V95, sheet Core_Power_Capacitors/0V95, sheet U_Arria10_Power/0V95
A10_0V9: port A10_0V9, sheet Core_Power_Capacitors/A10_0V9, sheet U_Arria10_Power/A10_0V9
A10_1V0: port A10_1V0, sheet IO_Power_Capacitors/A10_1V0, sheet U_Arria10_Power/A10_1V0
A10_VCCAPLL: port A10_VCCAPLL, sheet IO_Power_Capacitors/A10_VCCAPLL, sheet U_Arria10_Power/A10_VCCAPLL
A10_VCCLSENSE: port A10_VCCLSENSE, sheet U_Arria10_Power/A10_VCCLSENSE
A10VCCAPLLHPS: port A10VCCAPLLHPS, sheet IO_Power_Capacitors/A10VCCAPLLHPS, sheet U_Arria10_Power/A10VCCAPLLHPS
FMCBVADJ: port FMCBVADJ, sheet IO_Power_Capacitors/FMCBVADJ, sheet U_Arria10_Power/FMCBVADJ
GND: port GND, sheet Core_Power_Capacitors/GND, sheet IO_Power_Capacitors/GND, sheet U_Arria10_Ground/GND
HPS_0V95: port HPS_0V95, sheet Core_Power_Capacitors/HPS_0V95, sheet U_Arria10_Power/HPS_0V95
IO_1V8: port IO_1V8, sheet IO_Power_Capacitors/IO_1V8, sheet U_Arria10_Power/IO_1V8
PLL_1V8: port PLL_1V8, sheet IO_Power_Capacitors/PLL_1V8, sheet U_Arria10_Power/PLL_1V8
VCCIO_HPS: port VCCIO_HPS, sheet IO_Power_Capacitors/VCCIO_HPS, sheet U_Arria10_Power/VCCIO_HPS
VCCIOREF_HPS: port VCCIOREF_HPS, sheet IO_Power_Capacitors/VCCIOREF_HPS, sheet U_Arria10_Power/VCCIOREF_HPS
VDD_DDR: port VDD_DDR, sheet IO_Power_Capacitors/VDD_DDR, sheet U_Arria10_Power/VDD_DDR
HPS_CLK1: port HPS_CLK1, sheet U_HPS_Arria10/HPS_CLK1

### Buses and harness runs
harness port CLK_ENET_FPGA = sheet U_PCIE_Arria10/CLK_ENET_FPGA
harness port DDR4_ADDR_CTRL_CK = sheet U_DDR4_Arria10/DDR4_ADDR_CTRL_CK
harness port DDR4_BYTELINE0 = sheet U_DDR4_Arria10/DDR4_BYTELINE0
harness port DDR4_BYTELINE1 = sheet U_DDR4_Arria10/DDR4_BYTELINE1
harness port DDR4_BYTELINE2 = sheet U_DDR4_Arria10/DDR4_BYTELINE2
harness port DDR4_BYTELINE3 = sheet U_DDR4_Arria10/DDR4_BYTELINE3
harness port DDR4_SODIMM1_CK = sheet U_DDR4_SODIMM_Arria10/DDR4_SODIMM1_CK
harness port DDR4_SODIMM1_CTRL = sheet U_DDR4_SODIMM1_Arria10/DDR4_SODIMM1_CTRL
harness port DDR4_SODIMM2_CK = sheet U_DDR4_SODIMM_Arria10/DDR4_SODIMM2_CK
harness port DDR4_SODIMM2_CTRL = sheet U_DDR4_SODIMM1_Arria10/DDR4_SODIMM2_CTRL
harness port DDR4_SODIMM_ADDR = sheet U_DDR4_SODIMM_Arria10/DDR4_SODIMM_ADDR
harness port DDR4_SODIMM_BYTELINE0 = sheet U_DDR4_SODIMM_Arria10/DDR4_SODIMM_BYTELINE0
harness port DDR4_SODIMM_BYTELINE1 = sheet U_DDR4_SODIMM_Arria10/DDR4_SODIMM_BYTELINE1
harness port DDR4_SODIMM_BYTELINE2 = sheet U_DDR4_SODIMM_Arria10/DDR4_SODIMM_BYTELINE2
harness port DDR4_SODIMM_BYTELINE3 = sheet U_DDR4_SODIMM_Arria10/DDR4_SODIMM_BYTELINE3
harness port DDR4_SODIMM_BYTELINE4 = sheet U_DDR4_SODIMM1_Arria10/DDR4_SODIMM_BYTELINE4
harness port DDR4_SODIMM_BYTELINE5 = sheet U_DDR4_SODIMM1_Arria10/DDR4_SODIMM_BYTELINE5
harness port DDR4_SODIMM_BYTELINE6 = sheet U_DDR4_SODIMM1_Arria10/DDR4_SODIMM_BYTELINE6
harness port DDR4_SODIMM_BYTELINE7 = sheet U_DDR4_SODIMM1_Arria10/DDR4_SODIMM_BYTELINE7
harness port DDR4_SODIMM_CTRL = sheet U_DDR4_SODIMM1_Arria10/DDR4_SODIMM_CTRL
harness port DP_ML = sheet U_DP&SDI_Arria10/DP_ML
harness port ETHERNET_A_RX_TX = sheet U_PCIE_Arria10/ETHERNET_A_RX_TX
harness port ETHERNET_B_RX_TX = sheet U_PCIE_Arria10/ETHERNET_B_RX_TX
harness port ETHERNET_HPS = sheet U_HPS_Arria10/ETHERNET_HPS
harness port JTAG = sheet U_HPS1_Arria10/JTAG
harness port mini_PCIE = sheet U_miniPCIE_Arria10/mini_PCIE
harness port PCI_EXPRESS = sheet U_PCIE_Arria10/PCI_EXPRESS
harness port PCIE_REFCLK = sheet U_PCIE_Arria10/PCIE_REFCLK
harness port REFCLK0_FMCB = sheet U_2XSFP_Arria10/REFCLK0_FMCB
harness port REFCLK1_FMCB = sheet U_PCIE_Arria10/REFCLK1_FMCB
harness port REFCLK_DP = sheet U_DP&SDI_Arria10/REFCLK_DP
harness port REFCLK_SDI = sheet U_DP&SDI_Arria10/REFCLK_SDI
harness port REFCLK_SMA = sheet U_DP&SDI_Arria10/REFCLK_SMA
harness port SFP_PORT_A = sheet U_2XSFP_Arria10/SFP_PORT_A
harness port SFP_PORT_B = sheet U_2XSFP_Arria10/SFP_PORT_B
harness port USB3.0 = sheet U_USB3/USB3.0

### Notes on the sheet
- POWER
- GND
- DDR4
- JTAG
- SFP
- Clock
- 2XDDR4 SODIMM
- DISPLAY PORT
- ETHERNET
- Capacitors FPGA Arria 10
- Interfaces:
  1. Memory (DDR4, SODIMM DDR4)
  2. PCI Express
  3. USB 3.0
  4. Ethernet
  5. Mini PCI Express
  6. SFP
  7. Display Port
  8. JTAG
- USB 3.0
- PCI EXPRESS
- Mini PCI EXPRESS
- Title
- Size:
- Date:
- File:
- C
- Number:
- Time:
- Revision:
- Sheet
- of

## Sheet Core_Power_Decoupling.SchDoc: Core Power Decoupling
size B; DocumentNumber: 27; SheetNumber: 27; SheetTotal: 46
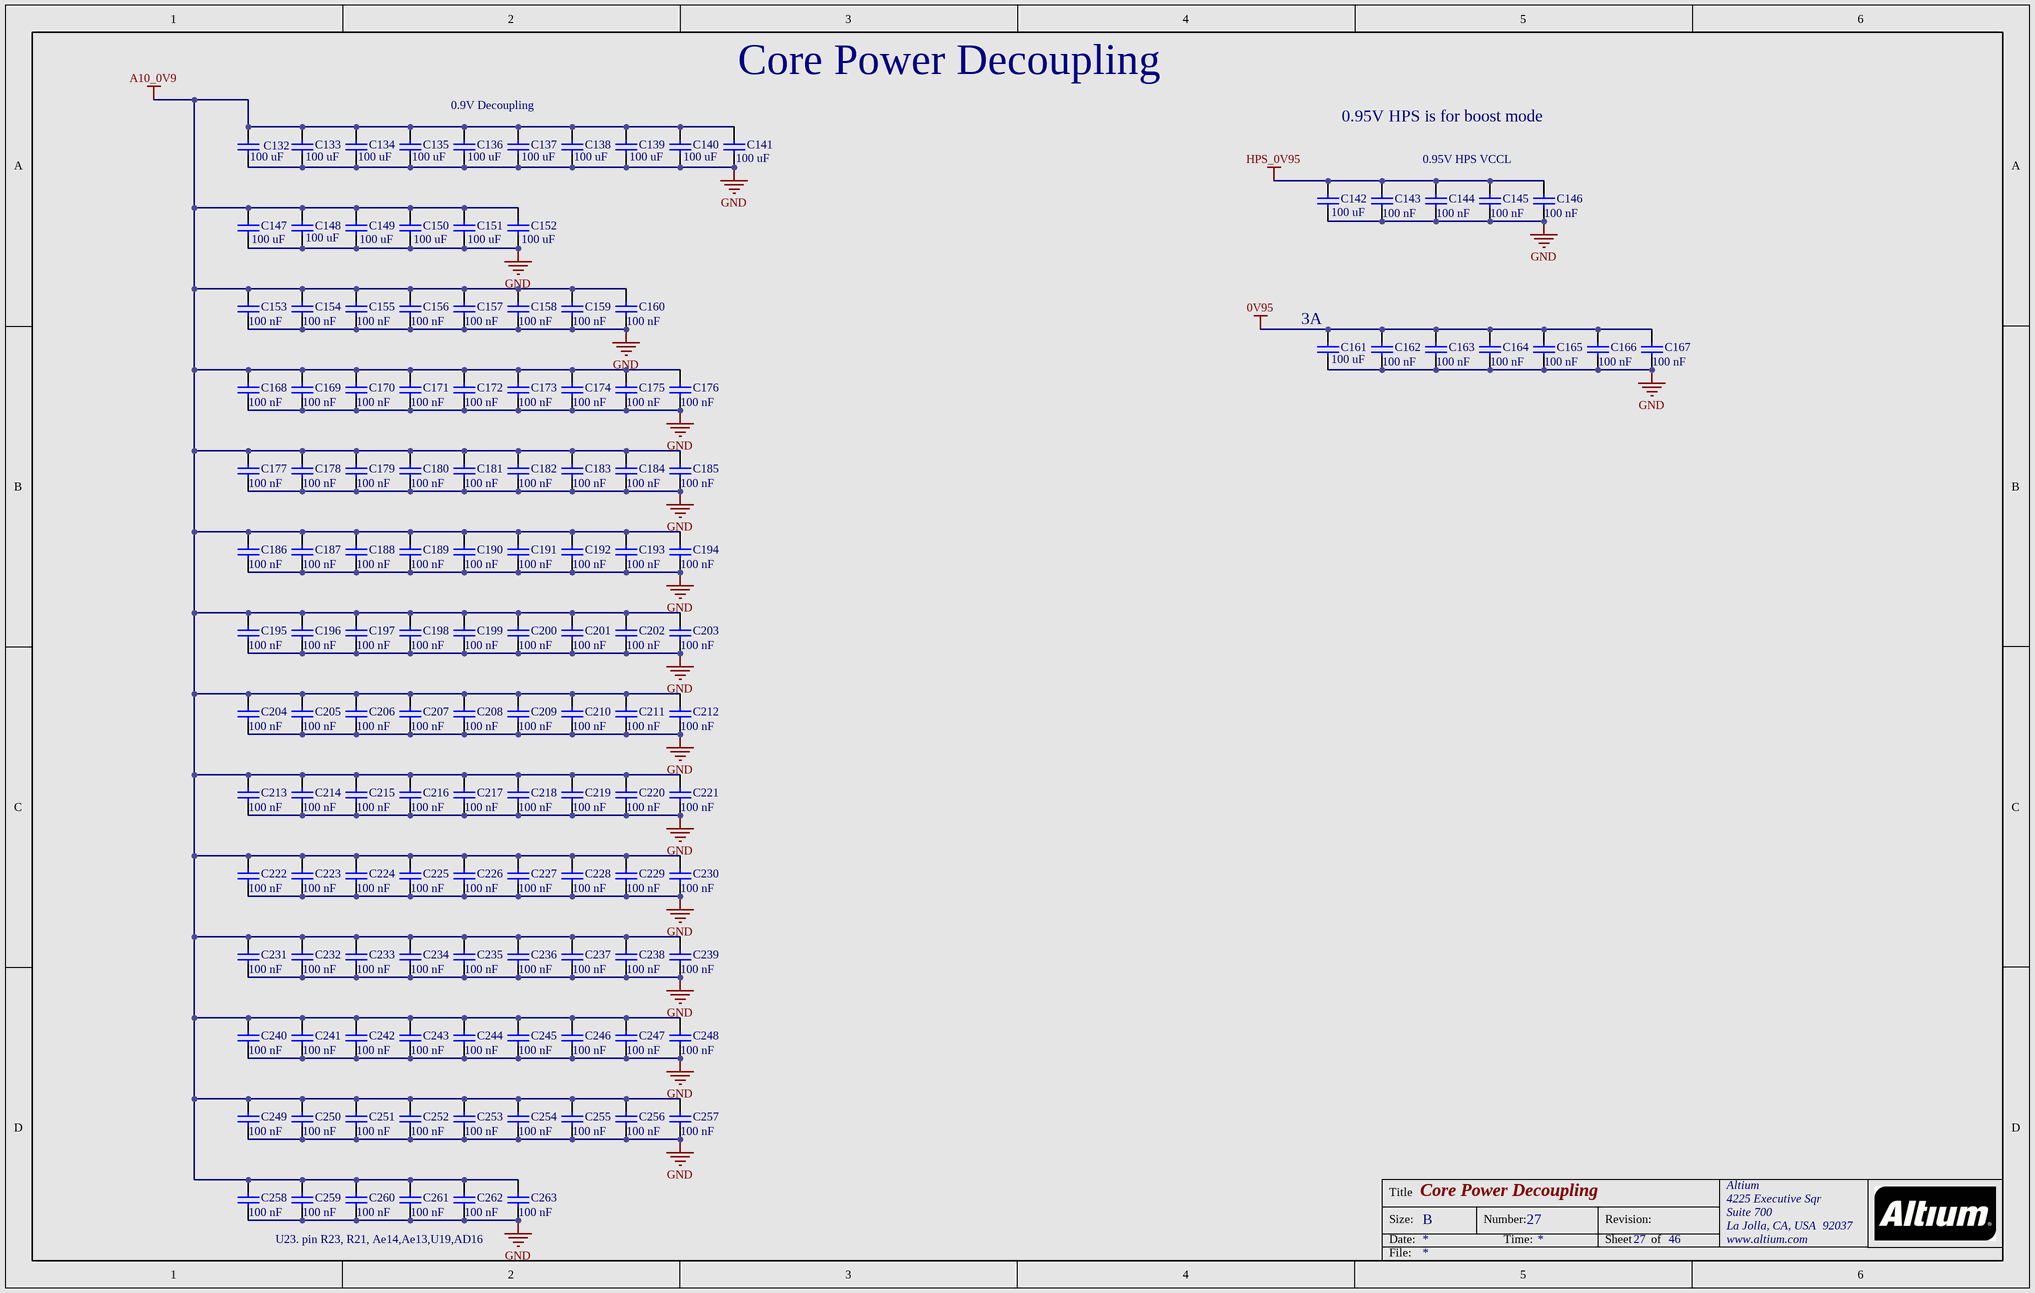
[diagram p7: Core_Power_Decoupling.SchDoc]

### Parts
C132  Capacitance: 100 uF  [CAPC3216X190X55ML30T25]  (hidden comment: GRM31CR60J107ME39L)
C133  Capacitance: 100 uF  [CAPC3216X190X55ML30T25]  (hidden comment: GRM31CR60J107ME39L)
C134  Capacitance: 100 uF  [CAPC3216X190X55ML30T25]  (hidden comment: GRM31CR60J107ME39L)
C135  Capacitance: 100 uF  [CAPC3216X190X55ML30T25]  (hidden comment: GRM31CR60J107ME39L)
C136  Capacitance: 100 uF  [CAPC3216X190X55ML30T25]  (hidden comment: GRM31CR60J107ME39L)
C137  Capacitance: 100 uF  [CAPC3216X190X55ML30T25]  (hidden comment: GRM31CR60J107ME39L)
C138  Capacitance: 100 uF  [CAPC3216X190X55ML30T25]  (hidden comment: GRM31CR60J107ME39L)
C139  Capacitance: 100 uF  [CAPC3216X190X55ML30T25]  (hidden comment: GRM31CR60J107ME39L)
C140  Capacitance: 100 uF  [CAPC3216X190X55ML30T25]  (hidden comment: GRM31CR60J107ME39L)
C141  Capacitance: 100 uF  [CAPC3216X190X55ML30T25]  (hidden comment: GRM31CR60J107ME39L)
C142  Capacitance: 100 uF  [CAPC3216X190X55ML30T25]  (hidden comment: GRM31CR60J107ME39L)
C143  Capacitance: 100 nF  [CAPC0603X33X15LL03T05]  (hidden comment: GRM033R60J104KE19D)
C144  Capacitance: 100 nF  [CAPC0603X33X15LL03T05]  (hidden comment: GRM033R60J104KE19D)
C145  Capacitance: 100 nF  [CAPC0603X33X15LL03T05]  (hidden comment: GRM033R60J104KE19D)
C146  Capacitance: 100 nF  [CAPC0603X33X15LL03T05]  (hidden comment: GRM033R60J104KE19D)
C147  Capacitance: 100 uF  [CAPC3216X190X55ML30T25]  (hidden comment: GRM31CR60J107ME39L)
C148  Capacitance: 100 uF  [CAPC3216X190X55ML30T25]  (hidden comment: GRM31CR60J107ME39L)
C149  Capacitance: 100 uF  [CAPC3216X190X55ML30T25]  (hidden comment: GRM31CR60J107ME39L)
C150  Capacitance: 100 uF  [CAPC3216X190X55ML30T25]  (hidden comment: GRM31CR60J107ME39L)
C151  Capacitance: 100 uF  [CAPC3216X190X55ML30T25]  (hidden comment: GRM31CR60J107ME39L)
C152  Capacitance: 100 uF  [CAPC3216X190X55ML30T25]  (hidden comment: GRM31CR60J107ME39L)
C153  Capacitance: 100 nF  [CAPC0603X33X15LL03T05]  (hidden comment: GRM033R60J104KE19D)
C154  Capacitance: 100 nF  [CAPC0603X33X15LL03T05]  (hidden comment: GRM033R60J104KE19D)
C155  Capacitance: 100 nF  [CAPC0603X33X15LL03T05]  (hidden comment: GRM033R60J104KE19D)
C156  Capacitance: 100 nF  [CAPC0603X33X15LL03T05]  (hidden comment: GRM033R60J104KE19D)
C157  Capacitance: 100 nF  [CAPC0603X33X15LL03T05]  (hidden comment: GRM033R60J104KE19D)
C158  Capacitance: 100 nF  [CAPC0603X33X15LL03T05]  (hidden comment: GRM033R60J104KE19D)
C159  Capacitance: 100 nF  [CAPC0603X33X15LL03T05]  (hidden comment: GRM033R60J104KE19D)
C160  Capacitance: 100 nF  [CAPC0603X33X15LL03T05]  (hidden comment: GRM033R60J104KE19D)
C161  Capacitance: 100 uF  [CAPC3216X190X55ML30T25]  (hidden comment: GRM31CR60J107ME39L)
C162  Capacitance: 100 nF  [CAPC0603X33X15LL03T05]  (hidden comment: GRM033R60J104KE19D)
C163  Capacitance: 100 nF  [CAPC0603X33X15LL03T05]  (hidden comment: GRM033R60J104KE19D)
C164  Capacitance: 100 nF  [CAPC0603X33X15LL03T05]  (hidden comment: GRM033R60J104KE19D)
C165  Capacitance: 100 nF  [CAPC0603X33X15LL03T05]  (hidden comment: GRM033R60J104KE19D)
C166  Capacitance: 100 nF  [CAPC0603X33X15LL03T05]  (hidden comment: GRM033R60J104KE19D)
C167  Capacitance: 100 nF  [CAPC0603X33X15LL03T05]  (hidden comment: GRM033R60J104KE19D)
C168  Capacitance: 100 nF  [CAPC0603X33X15LL03T05]  (hidden comment: GRM033R60J104KE19D)
C169  Capacitance: 100 nF  [CAPC0603X33X15LL03T05]  (hidden comment: GRM033R60J104KE19D)
C170  Capacitance: 100 nF  [CAPC0603X33X15LL03T05]  (hidden comment: GRM033R60J104KE19D)
C171  Capacitance: 100 nF  [CAPC0603X33X15LL03T05]  (hidden comment: GRM033R60J104KE19D)
C172  Capacitance: 100 nF  [CAPC0603X33X15LL03T05]  (hidden comment: GRM033R60J104KE19D)
C173  Capacitance: 100 nF  [CAPC0603X33X15LL03T05]  (hidden comment: GRM033R60J104KE19D)
C174  Capacitance: 100 nF  [CAPC0603X33X15LL03T05]  (hidden comment: GRM033R60J104KE19D)
C175  Capacitance: 100 nF  [CAPC0603X33X15LL03T05]  (hidden comment: GRM033R60J104KE19D)
C176  Capacitance: 100 nF  [CAPC0603X33X15LL03T05]  (hidden comment: GRM033R60J104KE19D)
C177  Capacitance: 100 nF  [CAPC0603X33X15LL03T05]  (hidden comment: GRM033R60J104KE19D)
C178  Capacitance: 100 nF  [CAPC0603X33X15LL03T05]  (hidden comment: GRM033R60J104KE19D)
C179  Capacitance: 100 nF  [CAPC0603X33X15LL03T05]  (hidden comment: GRM033R60J104KE19D)
C180  Capacitance: 100 nF  [CAPC0603X33X15LL03T05]  (hidden comment: GRM033R60J104KE19D)
C181  Capacitance: 100 nF  [CAPC0603X33X15LL03T05]  (hidden comment: GRM033R60J104KE19D)
C182  Capacitance: 100 nF  [CAPC0603X33X15LL03T05]  (hidden comment: GRM033R60J104KE19D)
C183  Capacitance: 100 nF  [CAPC0603X33X15LL03T05]  (hidden comment: GRM033R60J104KE19D)
C184  Capacitance: 100 nF  [CAPC0603X33X15LL03T05]  (hidden comment: GRM033R60J104KE19D)
C185  Capacitance: 100 nF  [CAPC0603X33X15LL03T05]  (hidden comment: GRM033R60J104KE19D)
C186  Capacitance: 100 nF  [CAPC0603X33X15LL03T05]  (hidden comment: GRM033R60J104KE19D)
C187  Capacitance: 100 nF  [CAPC0603X33X15LL03T05]  (hidden comment: GRM033R60J104KE19D)
C188  Capacitance: 100 nF  [CAPC0603X33X15LL03T05]  (hidden comment: GRM033R60J104KE19D)
C189  Capacitance: 100 nF  [CAPC0603X33X15LL03T05]  (hidden comment: GRM033R60J104KE19D)
C190  Capacitance: 100 nF  [CAPC0603X33X15LL03T05]  (hidden comment: GRM033R60J104KE19D)
C191  Capacitance: 100 nF  [CAPC0603X33X15LL03T05]  (hidden comment: GRM033R60J104KE19D)
C192  Capacitance: 100 nF  [CAPC0603X33X15LL03T05]  (hidden comment: GRM033R60J104KE19D)
C193  Capacitance: 100 nF  [CAPC0603X33X15LL03T05]  (hidden comment: GRM033R60J104KE19D)
C194  Capacitance: 100 nF  [CAPC0603X33X15LL03T05]  (hidden comment: GRM033R60J104KE19D)
C195  Capacitance: 100 nF  [CAPC0603X33X15LL03T05]  (hidden comment: GRM033R60J104KE19D)
C196  Capacitance: 100 nF  [CAPC0603X33X15LL03T05]  (hidden comment: GRM033R60J104KE19D)
C197  Capacitance: 100 nF  [CAPC0603X33X15LL03T05]  (hidden comment: GRM033R60J104KE19D)
C198  Capacitance: 100 nF  [CAPC0603X33X15LL03T05]  (hidden comment: GRM033R60J104KE19D)
C199  Capacitance: 100 nF  [CAPC0603X33X15LL03T05]  (hidden comment: GRM033R60J104KE19D)
C200  Capacitance: 100 nF  [CAPC0603X33X15LL03T05]  (hidden comment: GRM033R60J104KE19D)
C201  Capacitance: 100 nF  [CAPC0603X33X15LL03T05]  (hidden comment: GRM033R60J104KE19D)
C202  Capacitance: 100 nF  [CAPC0603X33X15LL03T05]  (hidden comment: GRM033R60J104KE19D)
C203  Capacitance: 100 nF  [CAPC0603X33X15LL03T05]  (hidden comment: GRM033R60J104KE19D)
C204  Capacitance: 100 nF  [CAPC0603X33X15LL03T05]  (hidden comment: GRM033R60J104KE19D)
C205  Capacitance: 100 nF  [CAPC0603X33X15LL03T05]  (hidden comment: GRM033R60J104KE19D)
C206  Capacitance: 100 nF  [CAPC0603X33X15LL03T05]  (hidden comment: GRM033R60J104KE19D)
C207  Capacitance: 100 nF  [CAPC0603X33X15LL03T05]  (hidden comment: GRM033R60J104KE19D)
C208  Capacitance: 100 nF  [CAPC0603X33X15LL03T05]  (hidden comment: GRM033R60J104KE19D)
C209  Capacitance: 100 nF  [CAPC0603X33X15LL03T05]  (hidden comment: GRM033R60J104KE19D)
C210  Capacitance: 100 nF  [CAPC0603X33X15LL03T05]  (hidden comment: GRM033R60J104KE19D)
C211  Capacitance: 100 nF  [CAPC0603X33X15LL03T05]  (hidden comment: GRM033R60J104KE19D)
C212  Capacitance: 100 nF  [CAPC0603X33X15LL03T05]  (hidden comment: GRM033R60J104KE19D)
C213  Capacitance: 100 nF  [CAPC0603X33X15LL03T05]  (hidden comment: GRM033R60J104KE19D)
C214  Capacitance: 100 nF  [CAPC0603X33X15LL03T05]  (hidden comment: GRM033R60J104KE19D)
C215  Capacitance: 100 nF  [CAPC0603X33X15LL03T05]  (hidden comment: GRM033R60J104KE19D)
C216  Capacitance: 100 nF  [CAPC0603X33X15LL03T05]  (hidden comment: GRM033R60J104KE19D)
C217  Capacitance: 100 nF  [CAPC0603X33X15LL03T05]  (hidden comment: GRM033R60J104KE19D)
C218  Capacitance: 100 nF  [CAPC0603X33X15LL03T05]  (hidden comment: GRM033R60J104KE19D)
C219  Capacitance: 100 nF  [CAPC0603X33X15LL03T05]  (hidden comment: GRM033R60J104KE19D)
C220  Capacitance: 100 nF  [CAPC0603X33X15LL03T05]  (hidden comment: GRM033R60J104KE19D)
C221  Capacitance: 100 nF  [CAPC0603X33X15LL03T05]  (hidden comment: GRM033R60J104KE19D)
C222  Capacitance: 100 nF  [CAPC0603X33X15LL03T05]  (hidden comment: GRM033R60J104KE19D)
C223  Capacitance: 100 nF  [CAPC0603X33X15LL03T05]  (hidden comment: GRM033R60J104KE19D)
C224  Capacitance: 100 nF  [CAPC0603X33X15LL03T05]  (hidden comment: GRM033R60J104KE19D)
C225  Capacitance: 100 nF  [CAPC0603X33X15LL03T05]  (hidden comment: GRM033R60J104KE19D)
C226  Capacitance: 100 nF  [CAPC0603X33X15LL03T05]  (hidden comment: GRM033R60J104KE19D)
C227  Capacitance: 100 nF  [CAPC0603X33X15LL03T05]  (hidden comment: GRM033R60J104KE19D)
C228  Capacitance: 100 nF  [CAPC0603X33X15LL03T05]  (hidden comment: GRM033R60J104KE19D)
C229  Capacitance: 100 nF  [CAPC0603X33X15LL03T05]  (hidden comment: GRM033R60J104KE19D)
C230  Capacitance: 100 nF  [CAPC0603X33X15LL03T05]  (hidden comment: GRM033R60J104KE19D)
C231  Capacitance: 100 nF  [CAPC0603X33X15LL03T05]  (hidden comment: GRM033R60J104KE19D)
C232  Capacitance: 100 nF  [CAPC0603X33X15LL03T05]  (hidden comment: GRM033R60J104KE19D)
C233  Capacitance: 100 nF  [CAPC0603X33X15LL03T05]  (hidden comment: GRM033R60J104KE19D)
C234  Capacitance: 100 nF  [CAPC0603X33X15LL03T05]  (hidden comment: GRM033R60J104KE19D)
C235  Capacitance: 100 nF  [CAPC0603X33X15LL03T05]  (hidden comment: GRM033R60J104KE19D)
C236  Capacitance: 100 nF  [CAPC0603X33X15LL03T05]  (hidden comment: GRM033R60J104KE19D)
C237  Capacitance: 100 nF  [CAPC0603X33X15LL03T05]  (hidden comment: GRM033R60J104KE19D)
C238  Capacitance: 100 nF  [CAPC0603X33X15LL03T05]  (hidden comment: GRM033R60J104KE19D)
C239  Capacitance: 100 nF  [CAPC0603X33X15LL03T05]  (hidden comment: GRM033R60J104KE19D)
C240  Capacitance: 100 nF  [CAPC0603X33X15LL03T05]  (hidden comment: GRM033R60J104KE19D)
C241  Capacitance: 100 nF  [CAPC0603X33X15LL03T05]  (hidden comment: GRM033R60J104KE19D)
C242  Capacitance: 100 nF  [CAPC0603X33X15LL03T05]  (hidden comment: GRM033R60J104KE19D)
C243  Capacitance: 100 nF  [CAPC0603X33X15LL03T05]  (hidden comment: GRM033R60J104KE19D)
C244  Capacitance: 100 nF  [CAPC0603X33X15LL03T05]  (hidden comment: GRM033R60J104KE19D)
C245  Capacitance: 100 nF  [CAPC0603X33X15LL03T05]  (hidden comment: GRM033R60J104KE19D)
C246  Capacitance: 100 nF  [CAPC0603X33X15LL03T05]  (hidden comment: GRM033R60J104KE19D)
C247  Capacitance: 100 nF  [CAPC0603X33X15LL03T05]  (hidden comment: GRM033R60J104KE19D)
C248  Capacitance: 100 nF  [CAPC0603X33X15LL03T05]  (hidden comment: GRM033R60J104KE19D)
C249  Capacitance: 100 nF  [CAPC0603X33X15LL03T05]  (hidden comment: GRM033R60J104KE19D)
C250  Capacitance: 100 nF  [CAPC0603X33X15LL03T05]  (hidden comment: GRM033R60J104KE19D)
C251  Capacitance: 100 nF  [CAPC0603X33X15LL03T05]  (hidden comment: GRM033R60J104KE19D)
C252  Capacitance: 100 nF  [CAPC0603X33X15LL03T05]  (hidden comment: GRM033R60J104KE19D)
C253  Capacitance: 100 nF  [CAPC0603X33X15LL03T05]  (hidden comment: GRM033R60J104KE19D)
C254  Capacitance: 100 nF  [CAPC0603X33X15LL03T05]  (hidden comment: GRM033R60J104KE19D)
C255  Capacitance: 100 nF  [CAPC0603X33X15LL03T05]  (hidden comment: GRM033R60J104KE19D)
C256  Capacitance: 100 nF  [CAPC0603X33X15LL03T05]  (hidden comment: GRM033R60J104KE19D)
C257  Capacitance: 100 nF  [CAPC0603X33X15LL03T05]  (hidden comment: GRM033R60J104KE19D)
C258  Capacitance: 100 nF  [CAPC0603X33X15LL03T05]  (hidden comment: GRM033R60J104KE19D)
C259  Capacitance: 100 nF  [CAPC0603X33X15LL03T05]  (hidden comment: GRM033R60J104KE19D)
C260  Capacitance: 100 nF  [CAPC0603X33X15LL03T05]  (hidden comment: GRM033R60J104KE19D)
C261  Capacitance: 100 nF  [CAPC0603X33X15LL03T05]  (hidden comment: GRM033R60J104KE19D)
C262  Capacitance: 100 nF  [CAPC0603X33X15LL03T05]  (hidden comment: GRM033R60J104KE19D)
C263  Capacitance: 100 nF  [CAPC0603X33X15LL03T05]  (hidden comment: GRM033R60J104KE19D)

### Nets
0V95: C161.2 C162.2 C163.2 C164.2 C165.2 C166.2 C167.2
A10_0V9: C132.2 C133.2 C134.2 C135.2 C136.2 C137.2 C138.2 C139.2 C140.2 C141.2 C147.2 C148.2 C149.2 C150.2 C151.2 C152.2 C153.2 C154.2 C155.2 C156.2 C157.2 C158.2 C159.2 C160.2 C168.2 C169.2 C170.2 C171.2 C172.2 C173.2 C174.2 C175.2 C176.2 C177.2 C178.2 C179.2 C180.2 C181.2 C182.2 C183.2 C184.2 C185.2 C186.2 C187.2 C188.2 C189.2 C190.2 C191.2 C192.2 C193.2 C194.2 C195.2 C196.2 C197.2 C198.2 C199.2 C200.2 C201.2 C202.2 C203.2 C204.2 C205.2 C206.2 C207.2 C208.2 C209.2 C210.2 C211.2 C212.2 C213.2 C214.2 C215.2 C216.2 C217.2 C218.2 C219.2 C220.2 C221.2 C222.2 C223.2 C224.2 C225.2 C226.2 C227.2 C228.2 C229.2 C230.2 C231.2 C232.2 C233.2 C234.2 C235.2 C236.2 C237.2 C238.2 C239.2 C240.2 C241.2 C242.2 C243.2 C244.2 C245.2 C246.2 C247.2 C248.2 C249.2 C250.2 C251.2 C252.2 C253.2 C254.2 C255.2 C256.2 C257.2 C258.2 C259.2 C260.2 C261.2 C262.2 C263.2
GND: C132.1 C133.1 C134.1 C135.1 C136.1 C137.1 C138.1 C139.1 C140.1 C141.1 C142.1 C143.1 C144.1 C145.1 C146.1 C147.1 C148.1 C149.1 C150.1 C151.1 C152.1 C153.1 C154.1 C155.1 C156.1 C157.1 C158.1 C159.1 C160.1 C161.1 C162.1 C163.1 C164.1 C165.1 C166.1 C167.1 C168.1 C169.1 C170.1 C171.1 C172.1 C173.1 C174.1 C175.1 C176.1 C177.1 C178.1 C179.1 C180.1 C181.1 C182.1 C183.1 C184.1 C185.1 C186.1 C187.1 C188.1 C189.1 C190.1 C191.1 C192.1 C193.1 C194.1 C195.1 C196.1 C197.1 C198.1 C199.1 C200.1 C201.1 C202.1 C203.1 C204.1 C205.1 C206.1 C207.1 C208.1 C209.1 C210.1 C211.1 C212.1 C213.1 C214.1 C215.1 C216.1 C217.1 C218.1 C219.1 C220.1 C221.1 C222.1 C223.1 C224.1 C225.1 C226.1 C227.1 C228.1 C229.1 C230.1 C231.1 C232.1 C233.1 C234.1 C235.1 C236.1 C237.1 C238.1 C239.1 C240.1 C241.1 C242.1 C243.1 C244.1 C245.1 C246.1 C247.1 C248.1 C249.1 C250.1 C251.1 C252.1 C253.1 C254.1 C255.1 C256.1 C257.1 C258.1 C259.1 C260.1 C261.1 C262.1 C263.1
HPS_0V95: C142.2 C143.2 C144.2 C145.2 C146.2

### Notes on the sheet
- 0.9V Decoupling
- 0.95V HPS is for boost mode
- 0.95V HPS VCCL
- (near C161) 3A
- U23. pin R23, R21, Ae14,Ae13,U19,AD16
- Title
- Size:
- Date:
- B
- Number:
- Time:
- Revision:
- Sheet
- of
- File:

### Library data of the parts
C132-C142 C147-C152 C161 = CMP-1662-00011-2: Chip Capacitor, 100 uF, +/- 20%, 6.3 V, -55 to 85 degC, 1206 (3216 Metric), RoHS, Tape and Reel; Voltage Rating: 6.3 V; Type (Capacitors): X5R; Case\/Package: 1206; Tolerance: 20%; ComponentLink1URL: http://www.murata.com/; ComponentLink1Description: Manufacturer URL; PackageDescription: 2-Pin Surface Mount Device, Body 3.2 x 1.6 mm; Max Operating Temperature: 85 degC; Case Code (Imperial): 1206; PackageReference: 1206; Height: 1.6 mm; Width: 1.6 mm; Packaging: Tape and Reel; DatasheetVersion: 09/2016; REACH SVHC: No SVHC; Mounting Technology: Surface Mount; Case Code (Metric): 3216; Min Operating Temperature: -55 degC; RoHSCompliant: true; Radiation Hardening: No; Voltage Rating (DC): 6.3 V; Package Quantity: 2000; ComponentLink2Description: Datasheet; Mount: Surface Mount; Length: 3.2 mm; ComponentLink2URL: http://psearch.en.murata.com/capacitor/product/GRM31CR60J107ME39%23.pdf; Pins: 2; PartNumber: GRM31CR60J107ME39L
C143-C146 C153-C160 C162-C263 = CMP-2010-01652-4: Chip Capacitor, 100 nF, +/- 10%, 6.3 V, -55 to 85 degC, 0201 (0603 Metric), RoHS, Tape and Reel; Manufacturer: Basic Passives; Voltage Rating: 6.3 V; Type (Capacitors): X5R; Voltage Rating (DC): 3 V; Case\/Package: 0201; Tolerance: 10%; Min Operating Temperature: -55 degC; PartNumber: GRM033R60J104KE19D; Mounting Technology: Surface Mount; RoHSCompliant: true; Max Operating Temperature: 85 degC; Package Quantity: 15000; Packaging: Tape and Reel; Case Code (Imperial): 0201; Width: 0.3 mm; ComponentLink1URL: http://www.murata.com/; Case Code (Metric): 0603; ComponentLink1Description: Manufacturer URL; REACH SVHC: No SVHC; Height: 0.3 mm; Length: 0.6 mm; PackageDescription: 2-Pin Surface Mount Device, Body 0.6 x 0.3 mm; ComponentLink2Description: Datasheet; Pins: 2; PackageReference: 0201; Mount: Surface Mount; ComponentLink2URL: http://search.murata.co.jp/Ceramy/image/img/A01X/G101/ENG/GRM033R60J104KE19-01.pdf; DatasheetVersion: 03/2016; Radiation Hardening: No